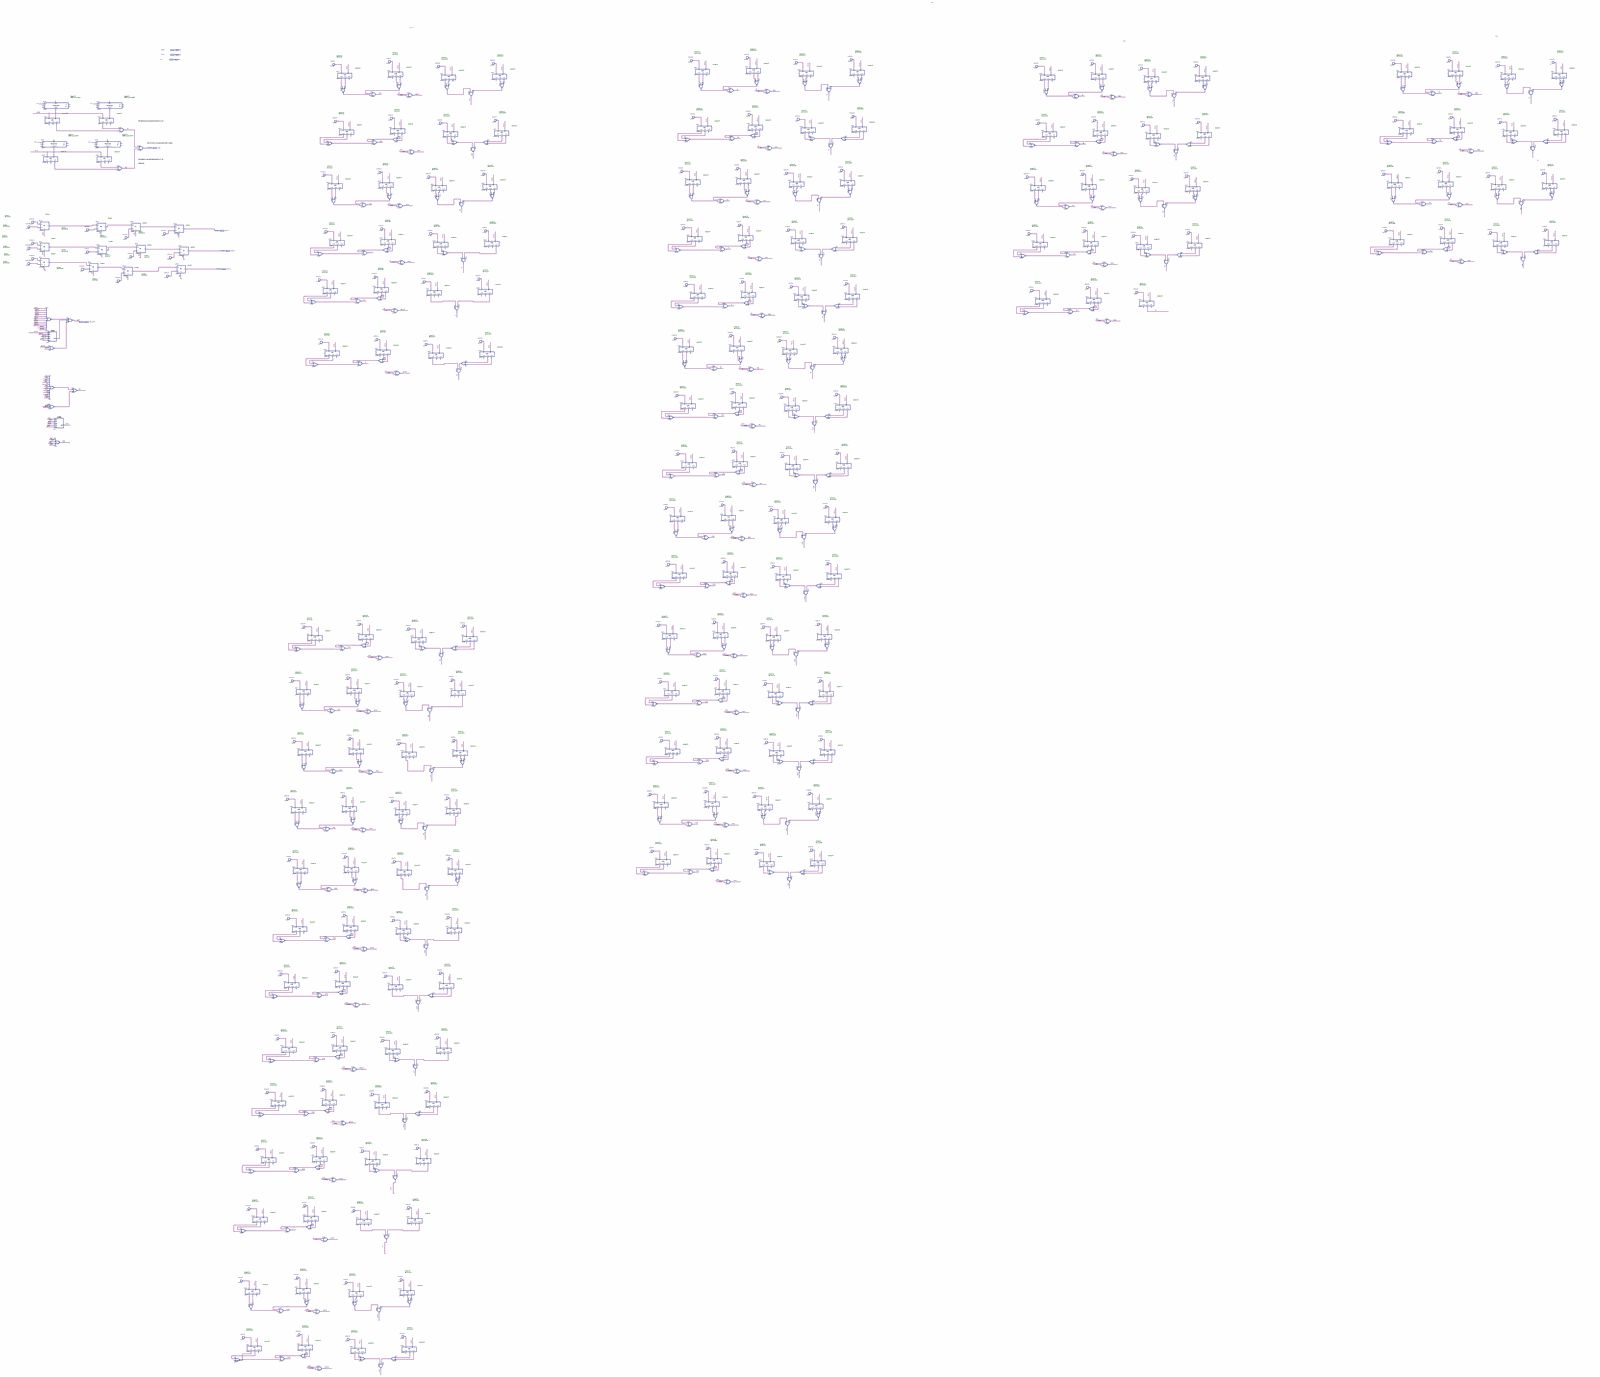
[diagram p0: schematic sheet, whole]
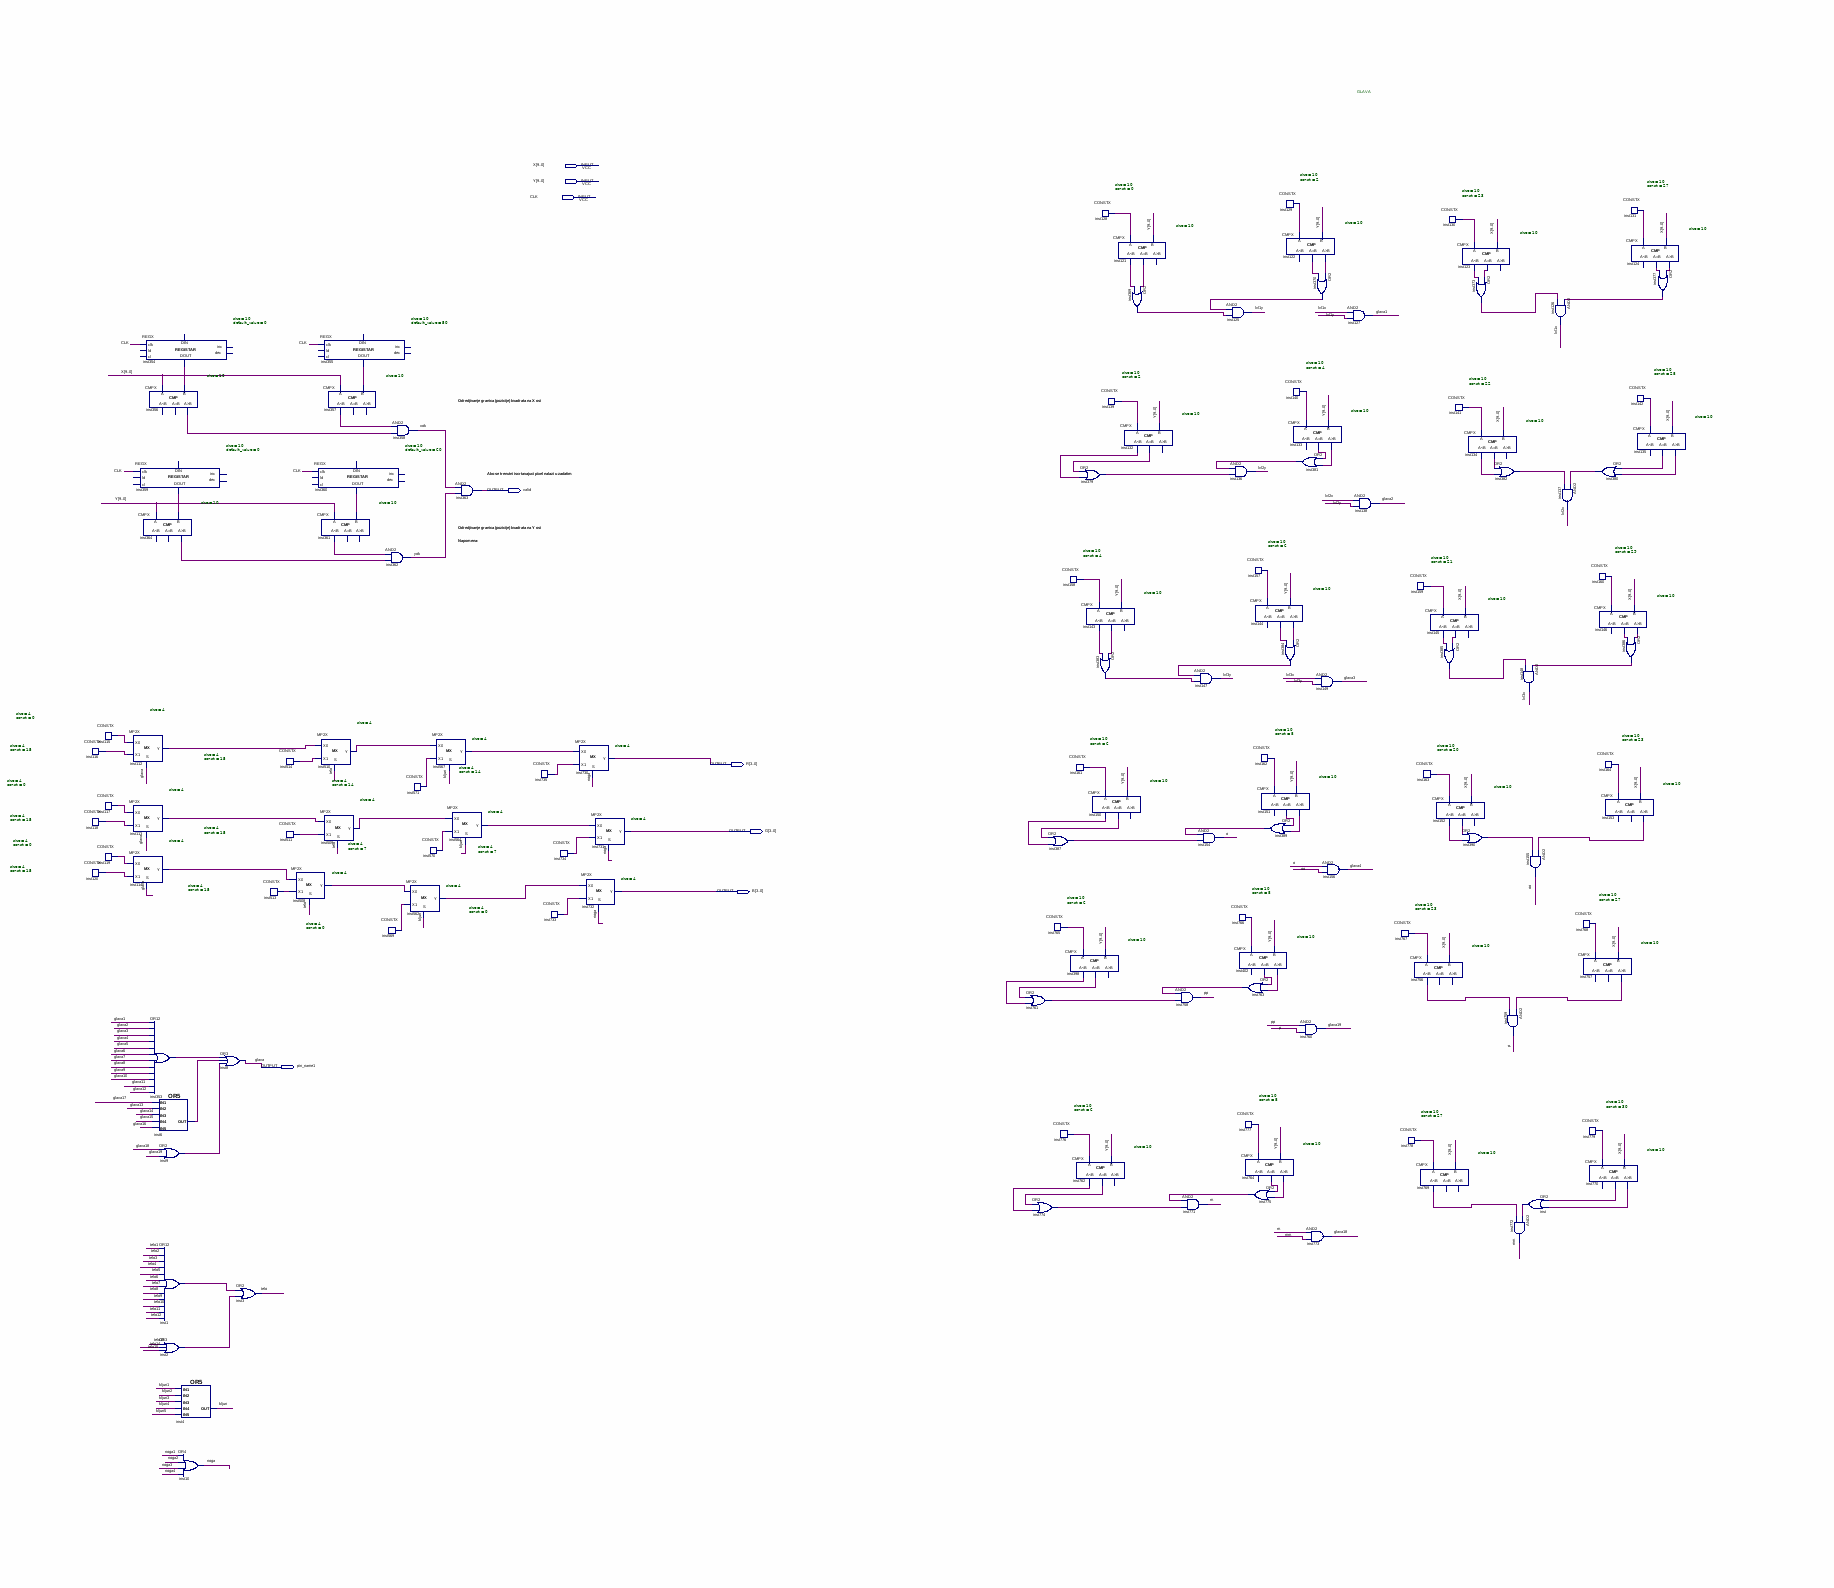
[diagram p1: schematic sheet, upper left part]
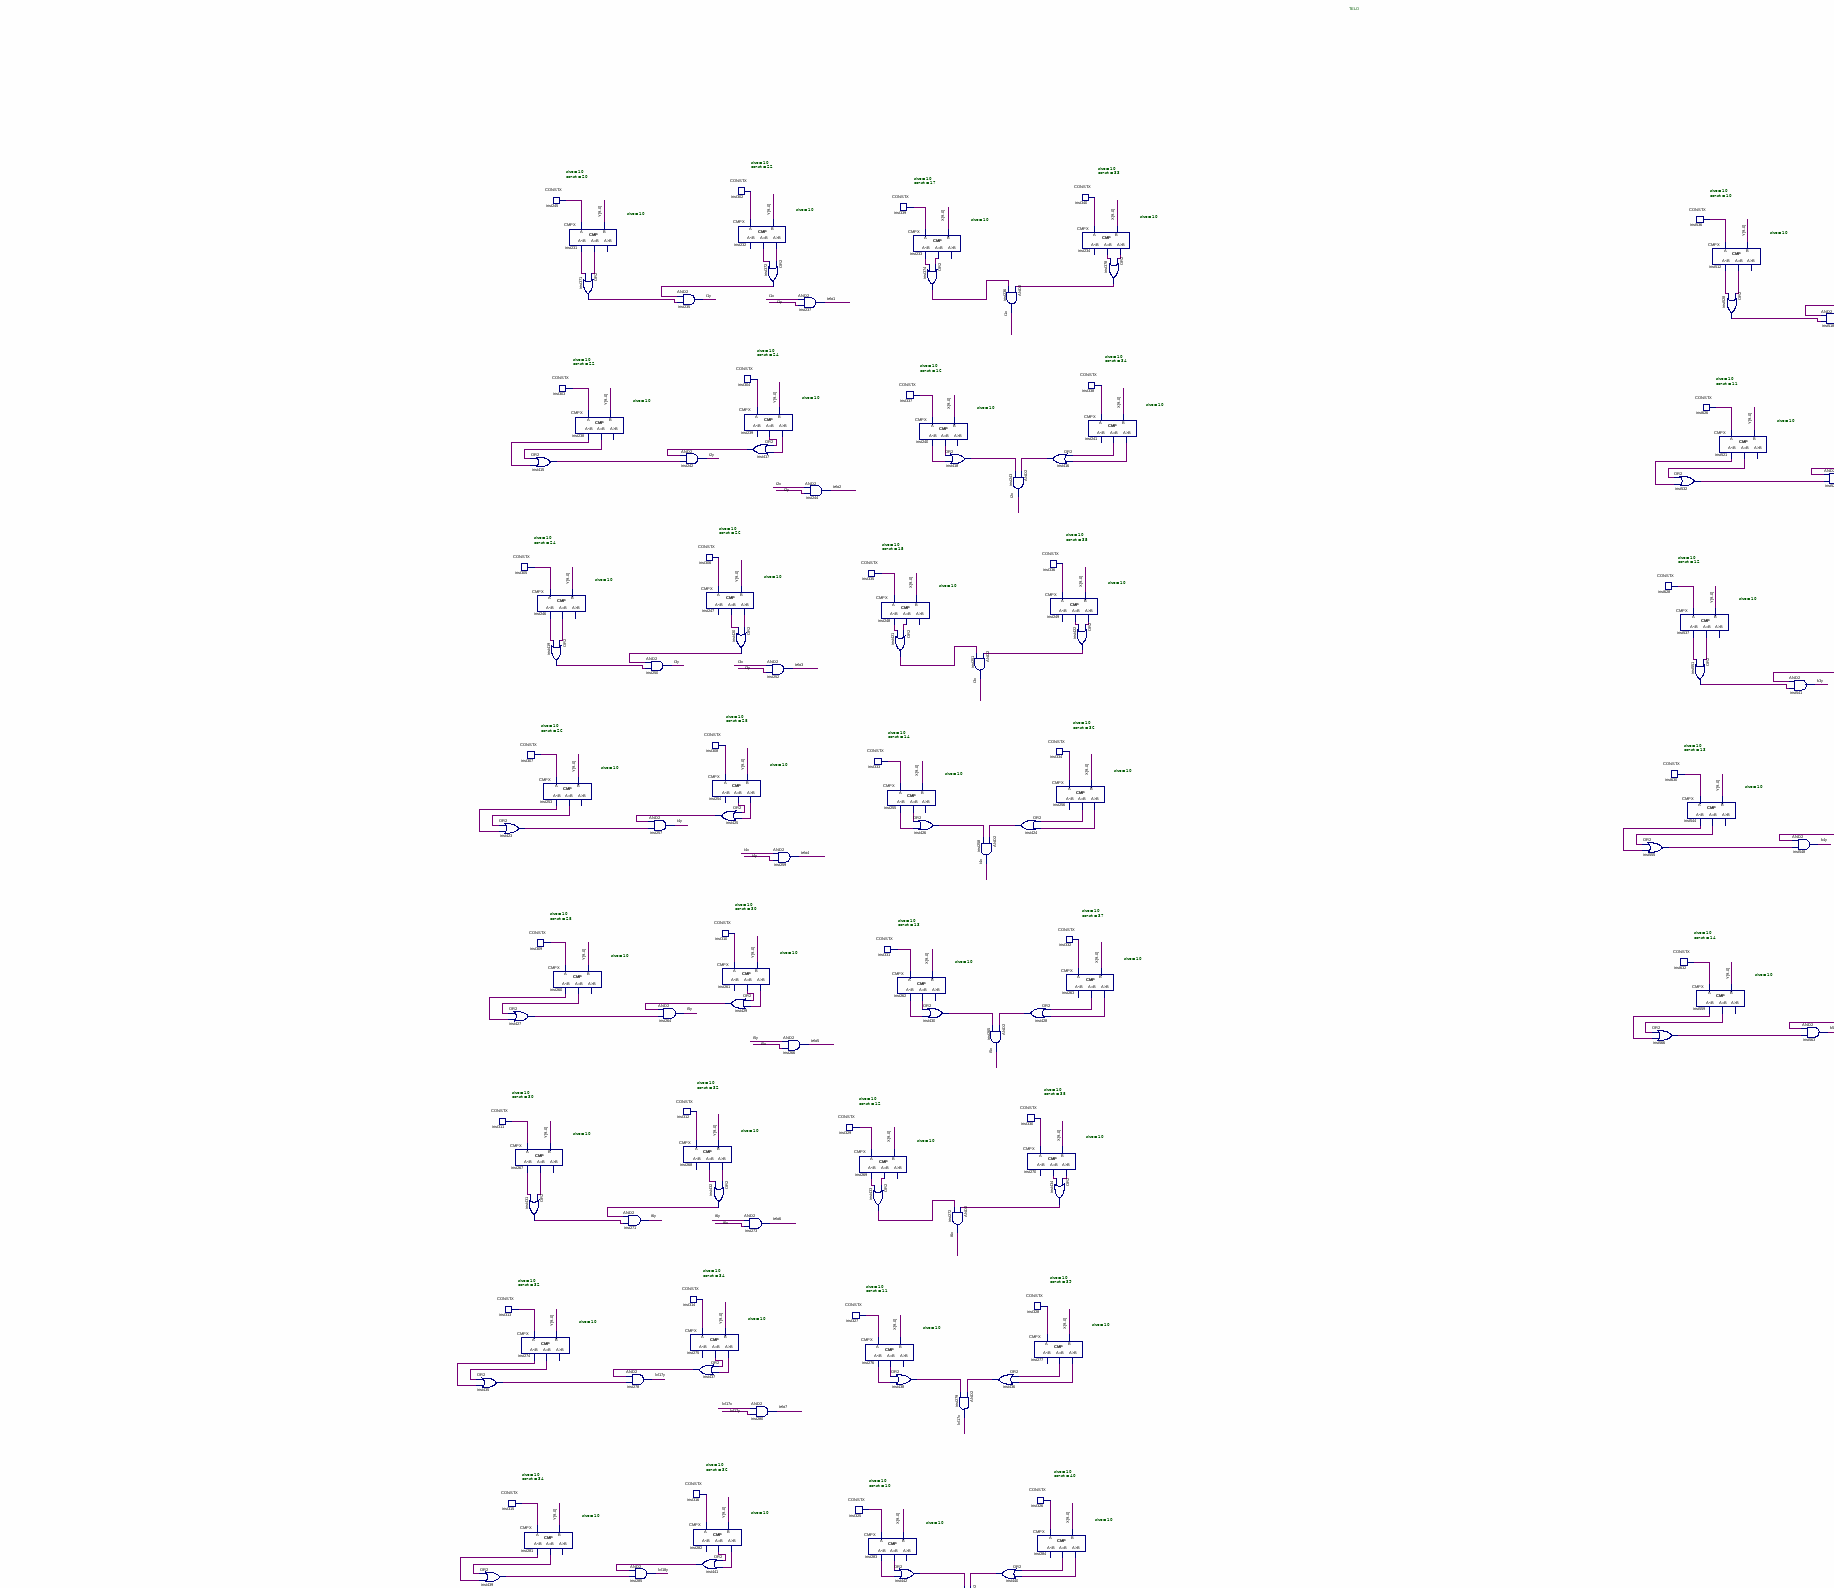
[diagram p2: schematic sheet, upper centre part]
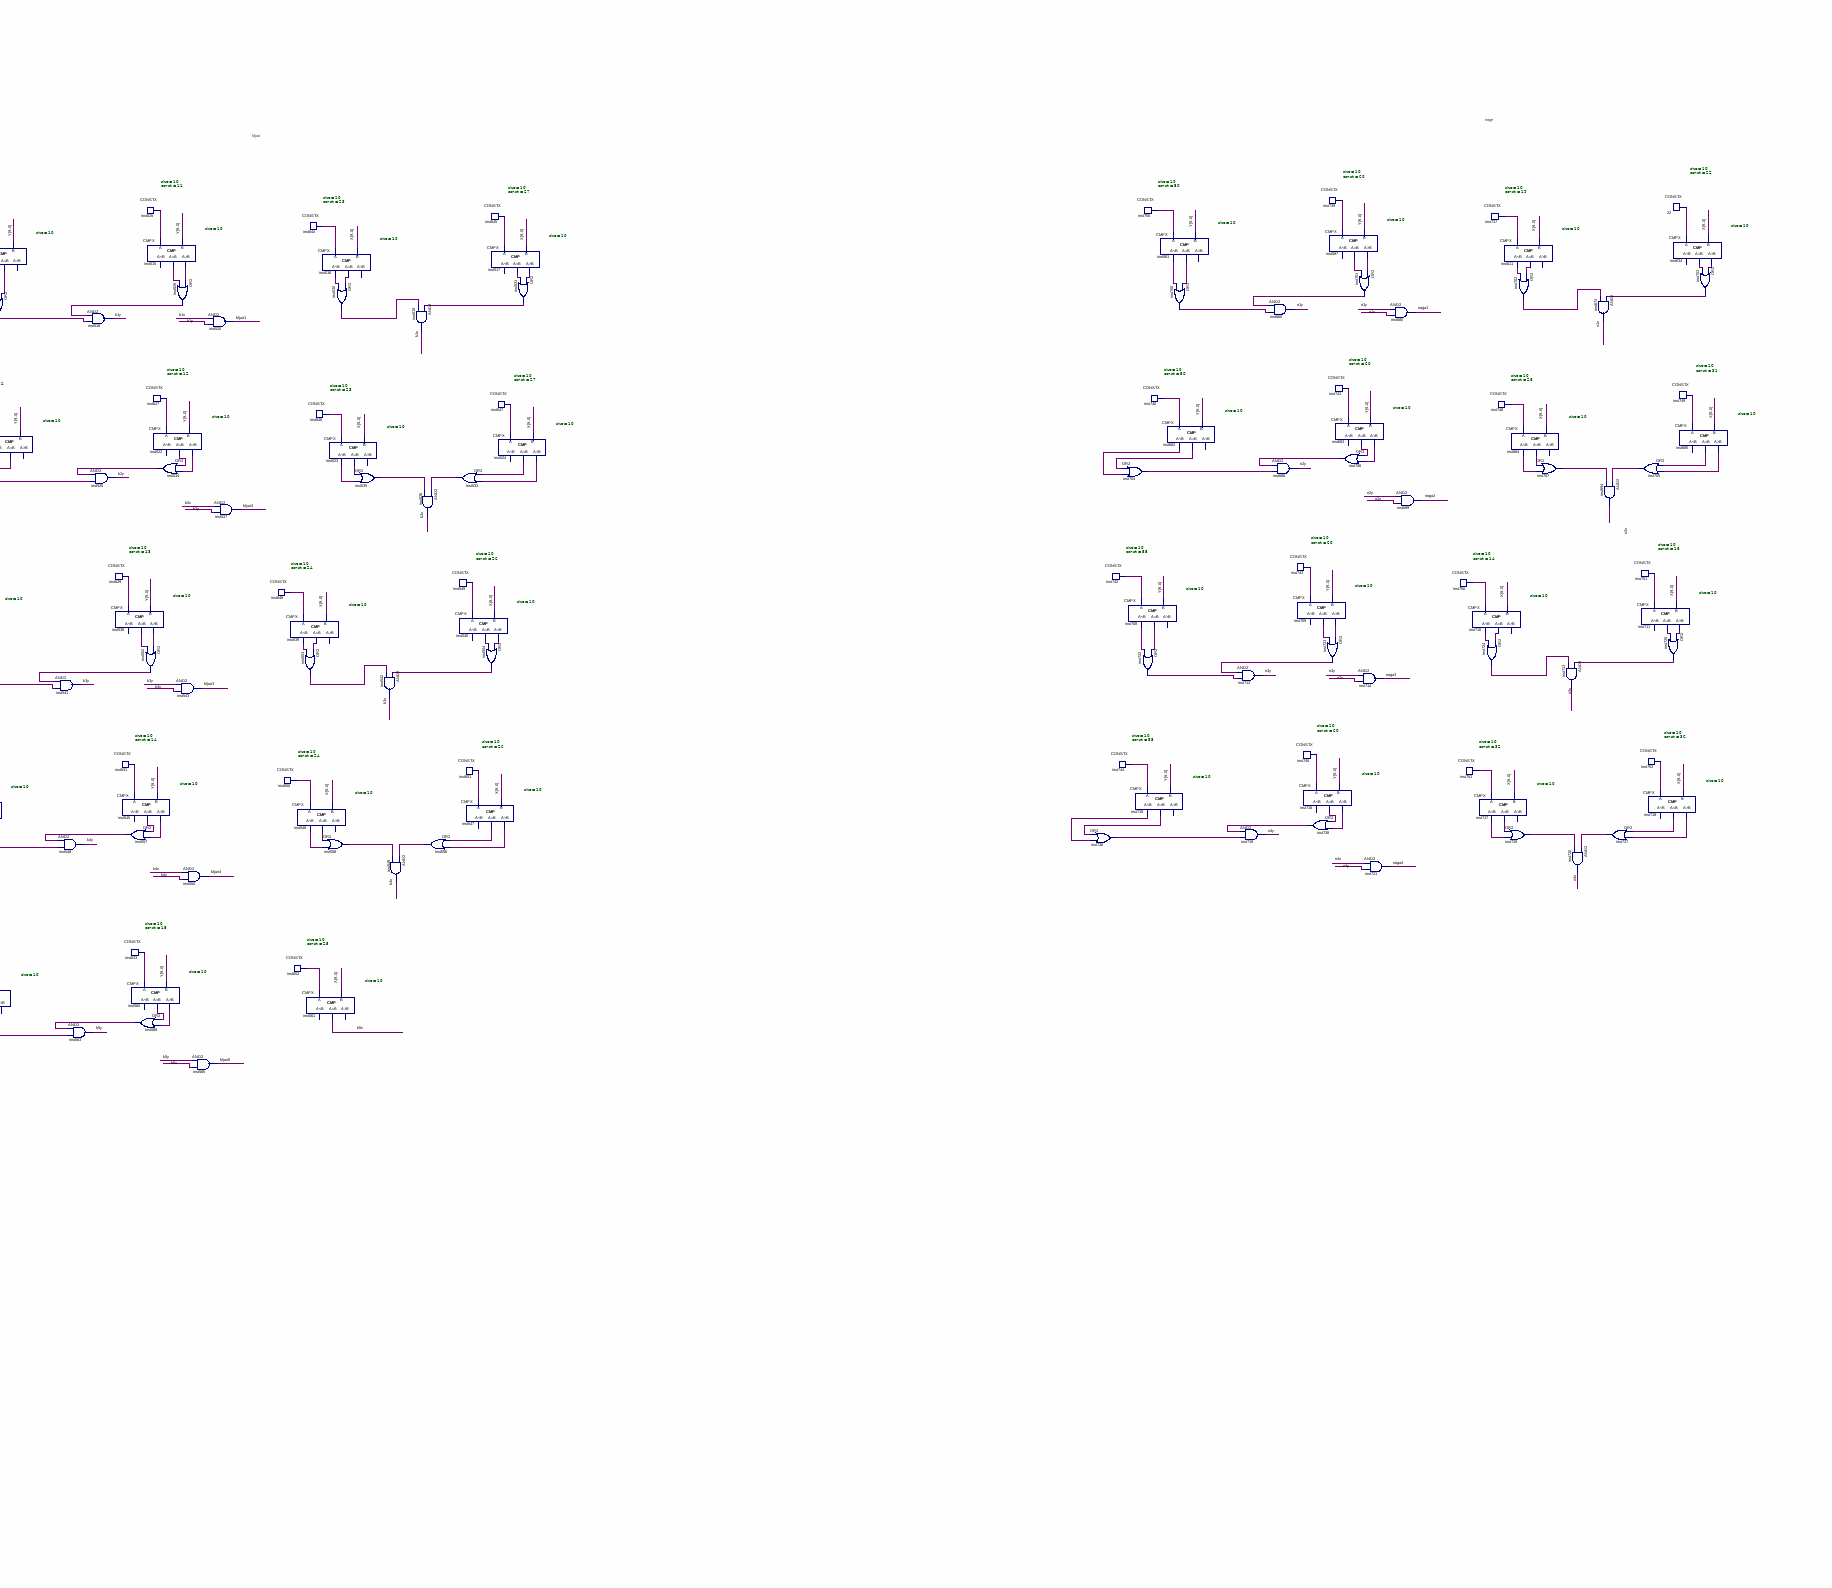
[diagram p3: schematic sheet, upper right part]
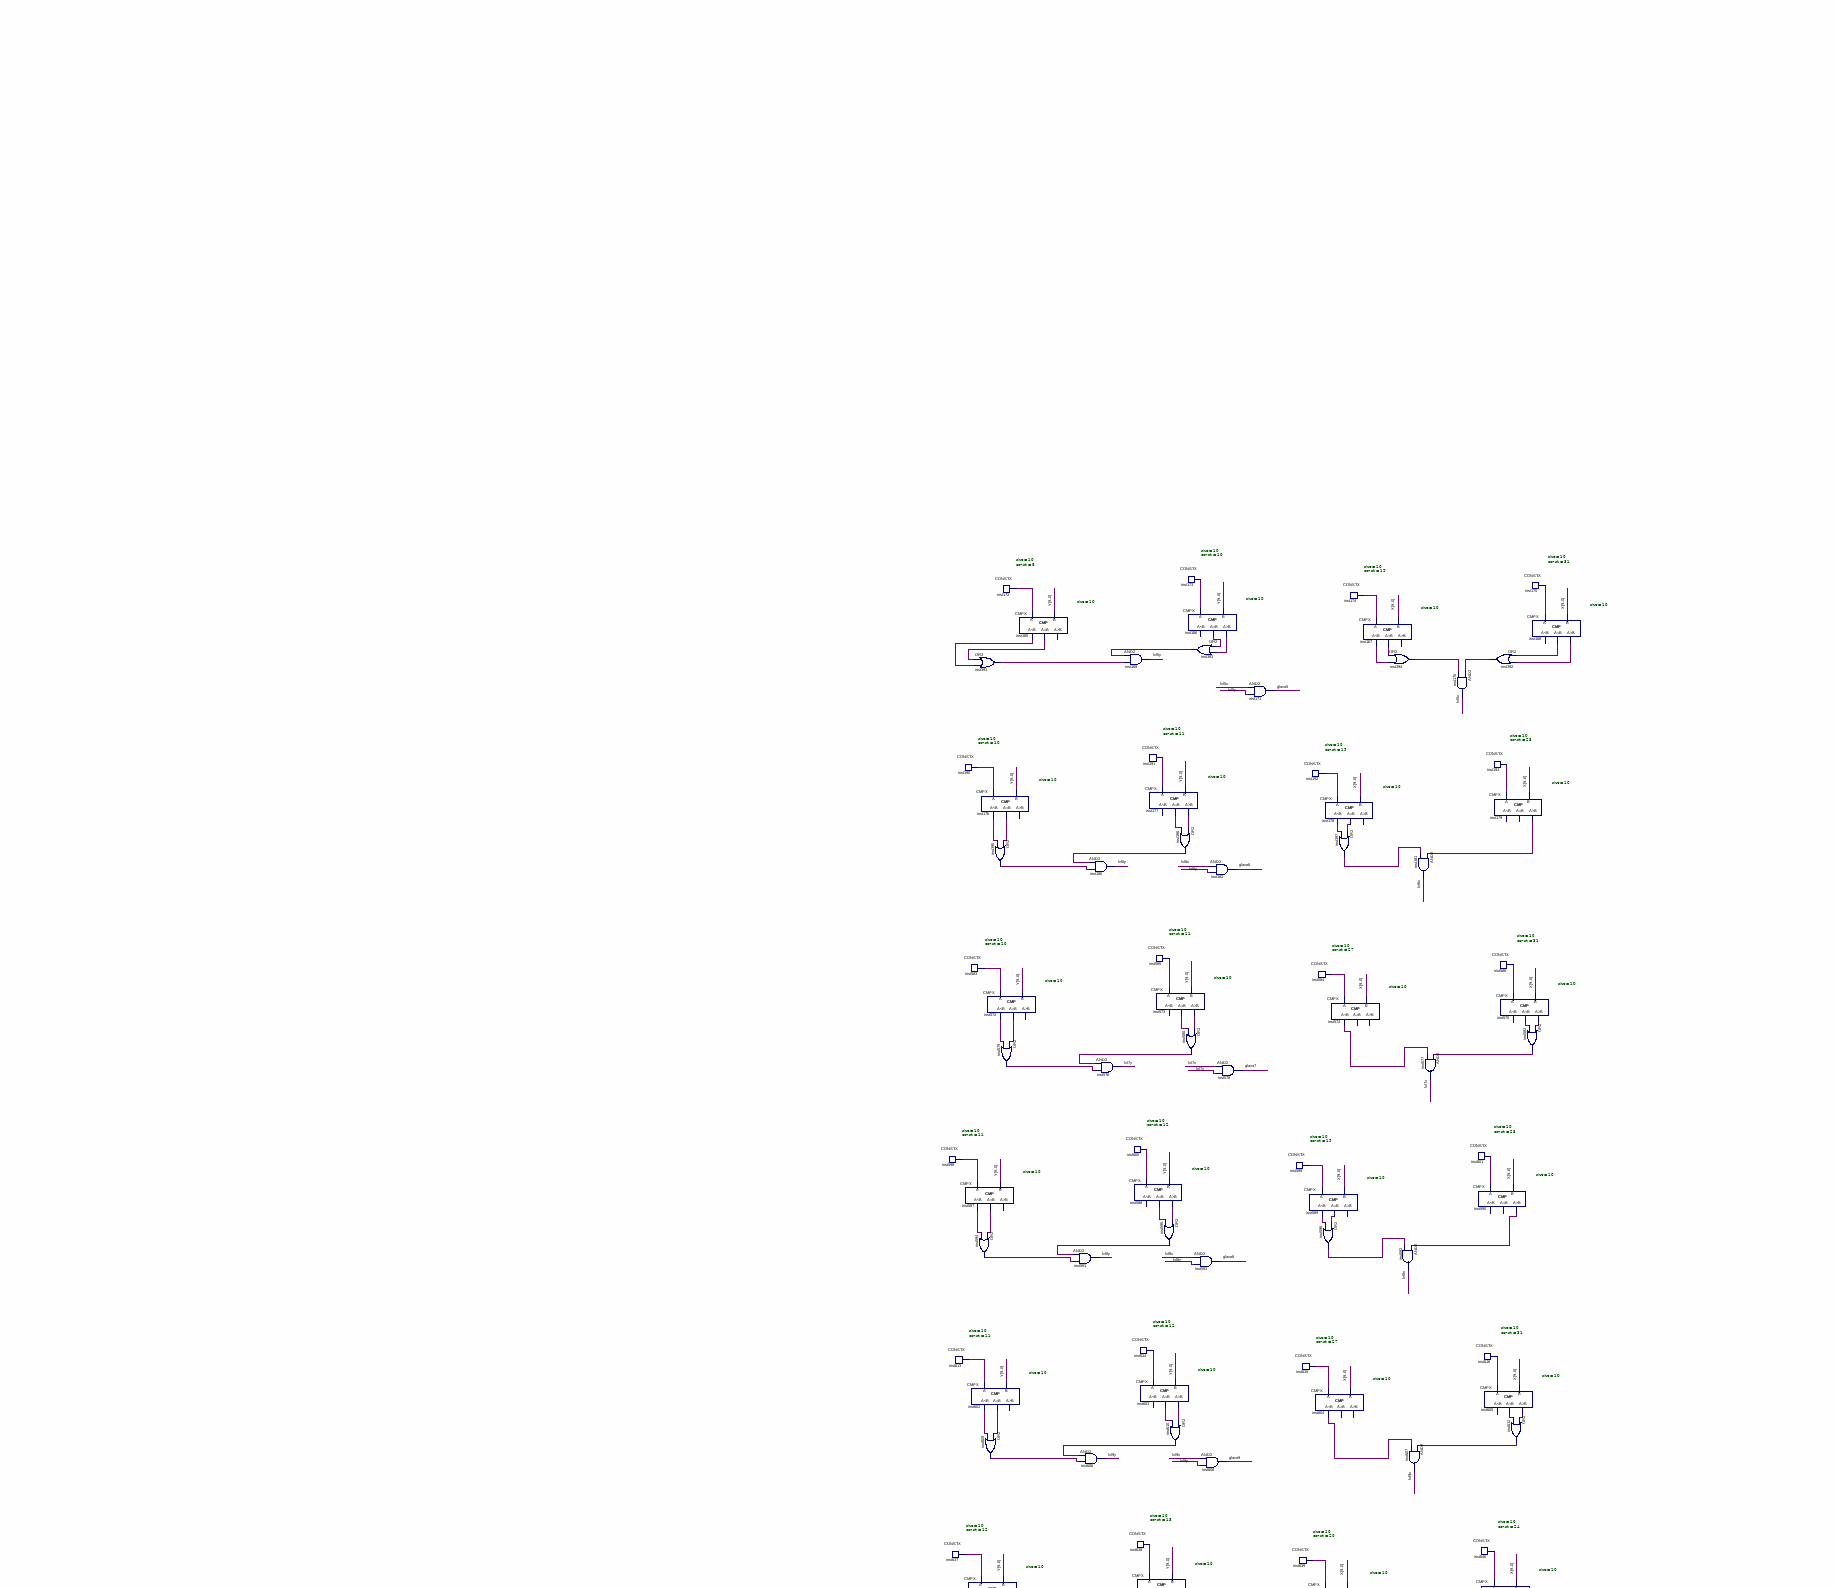
[diagram p4: schematic sheet, middle left part]
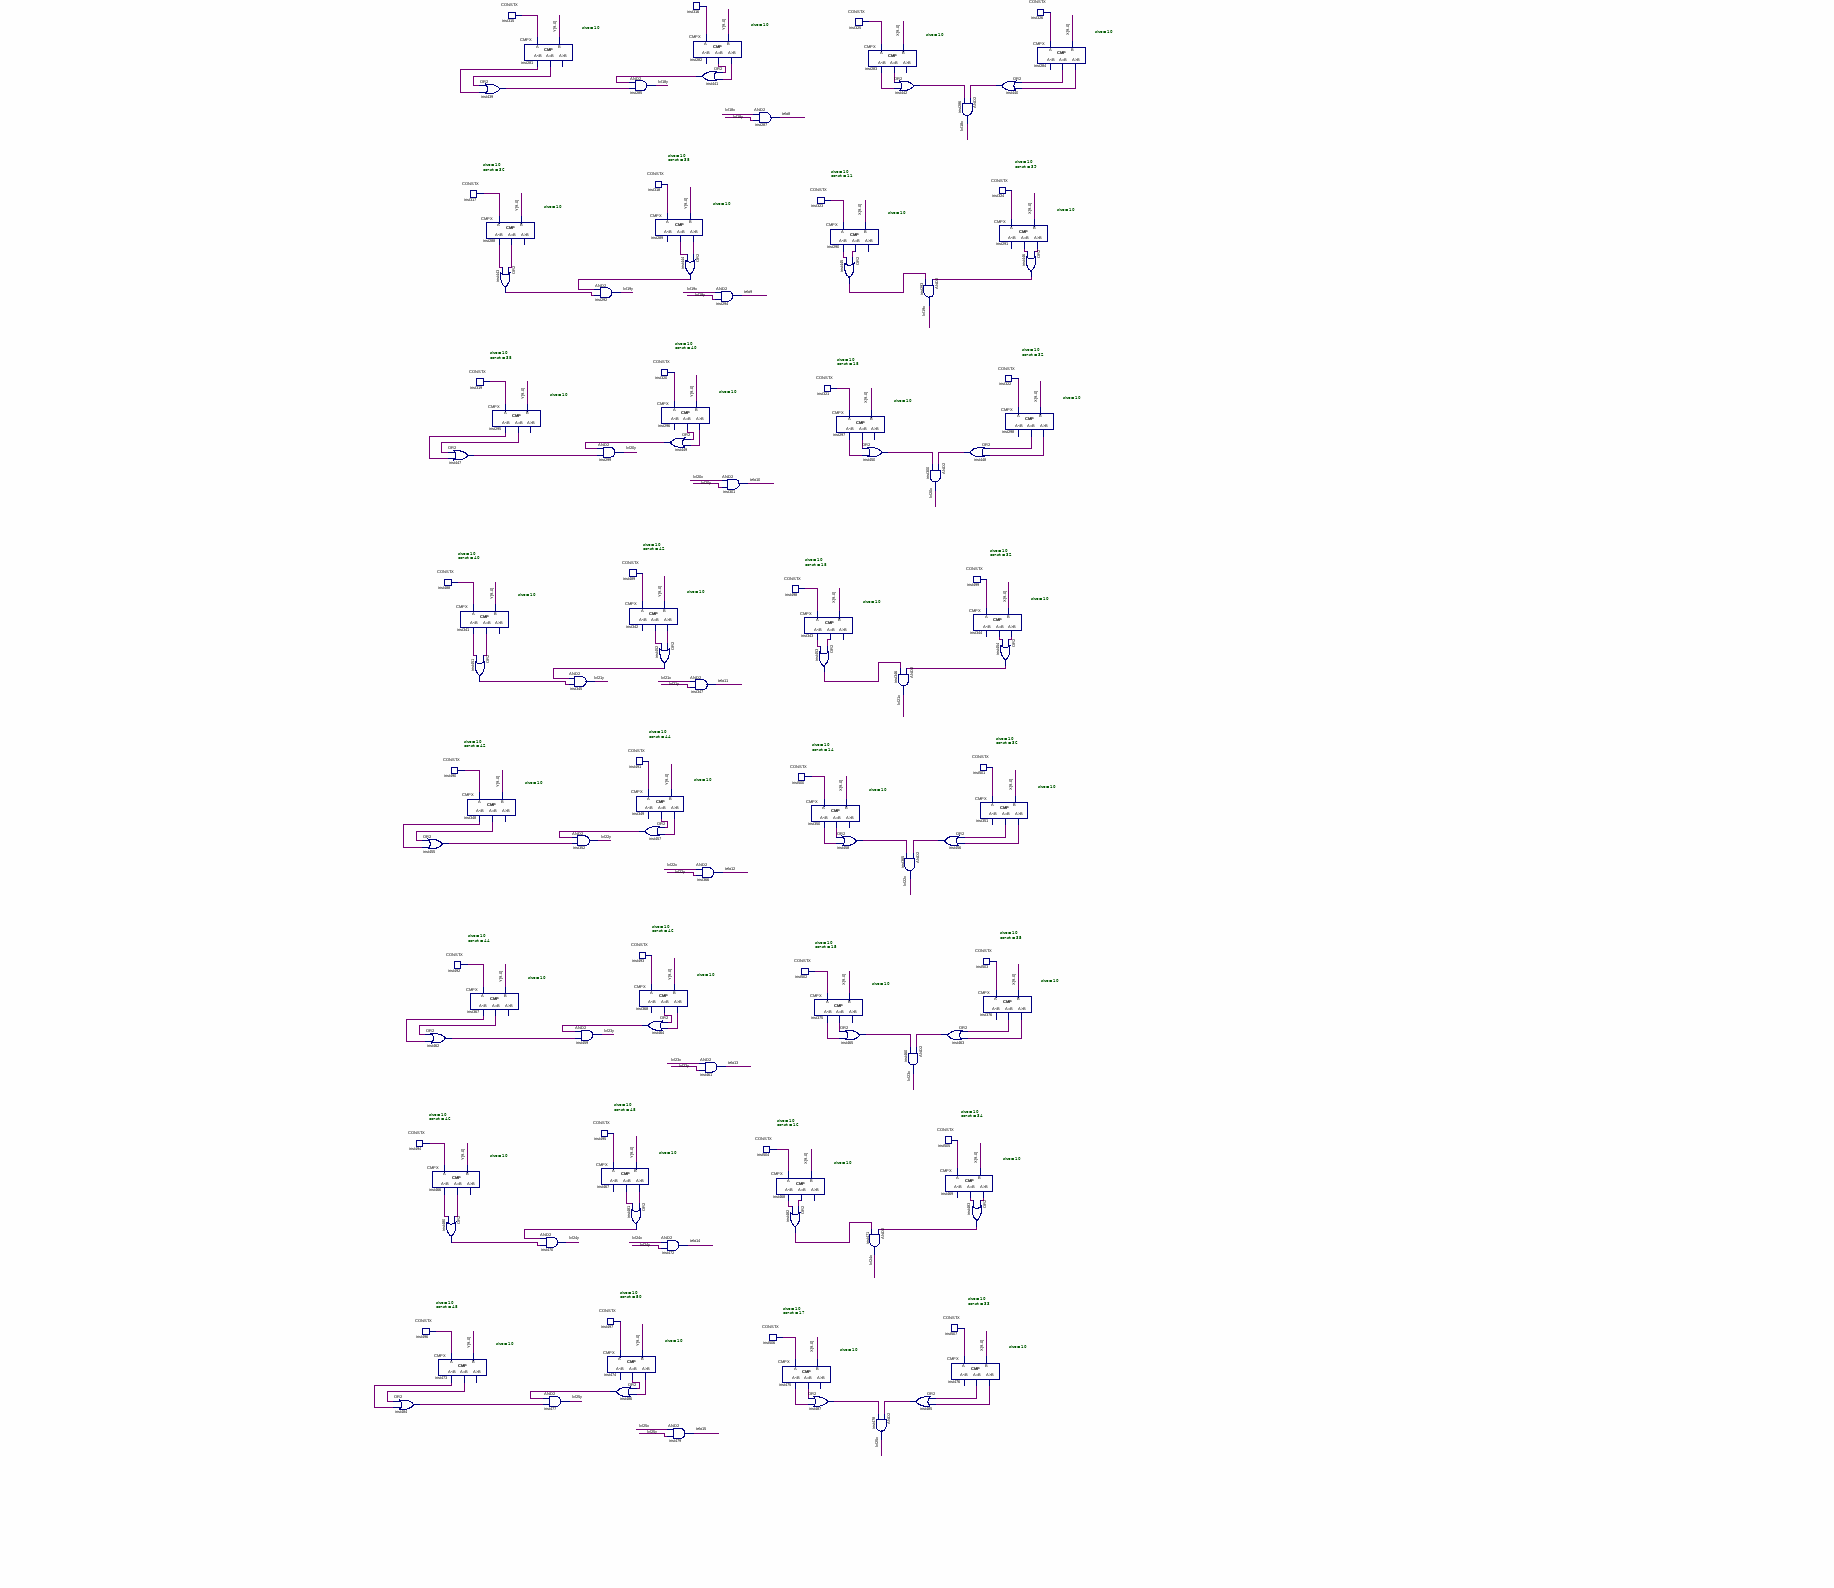
[diagram p5: schematic sheet, middle centre part]
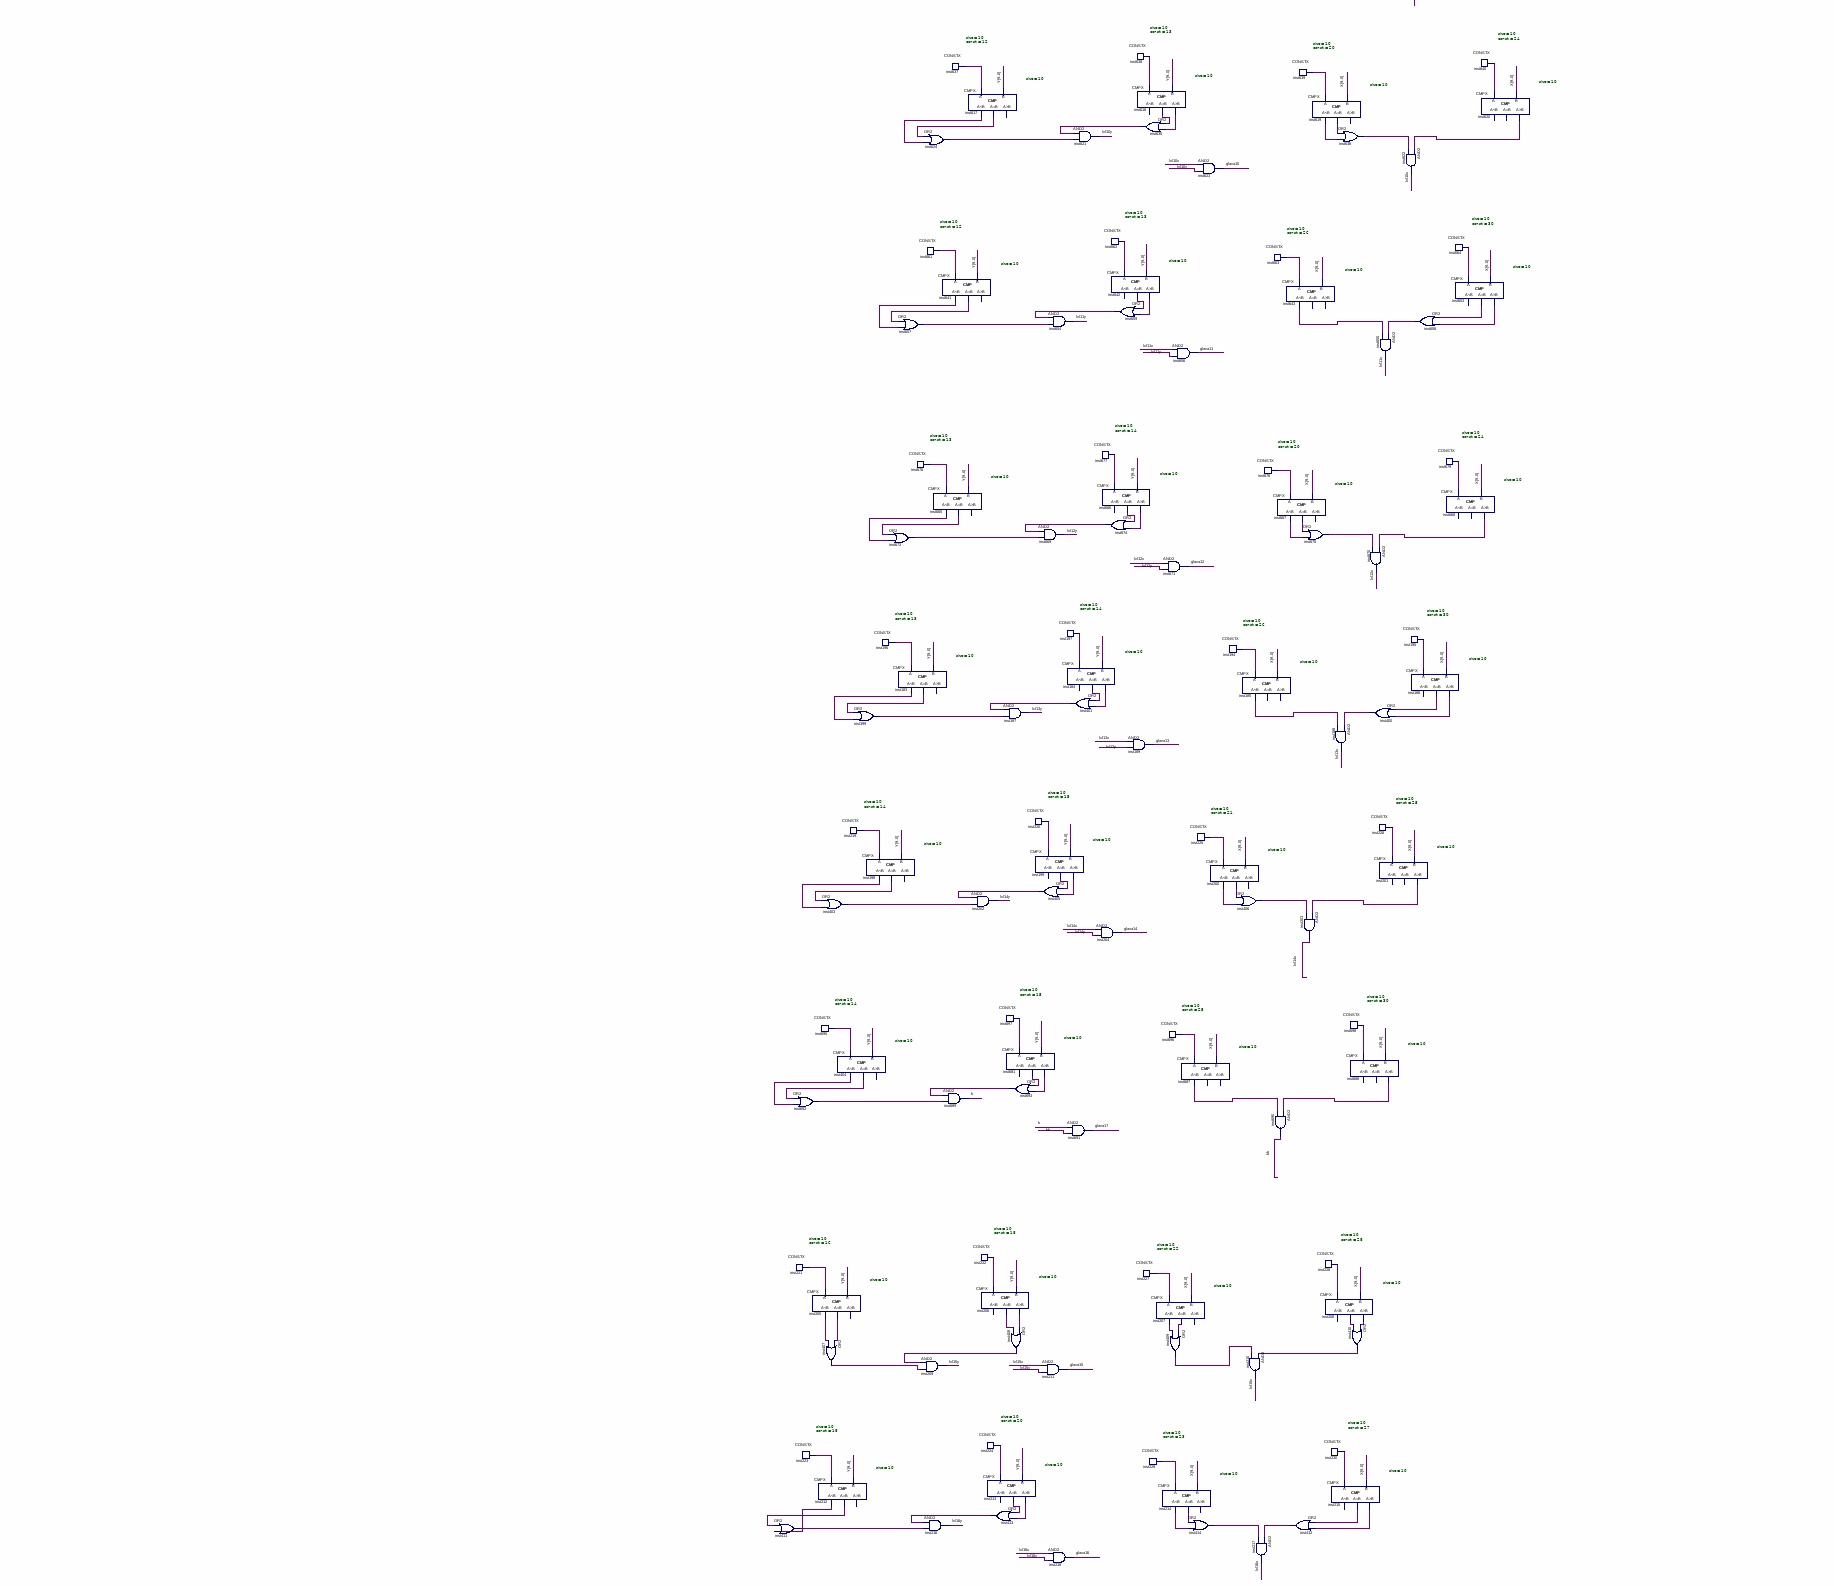
[diagram p6: schematic sheet, lower left part]
// Quartus schematic JAJE.bdf as structural Verilog: 672 symbols, 8 pins
module JAJE (
  input  [9:0] X,
  input  [9:0] Y,
  input  CLK,
  output valid,
  output [3:0] R,
  output [3:0] G,
  output [3:0] B,
  output pin_name1
);

  wire glava1, glava2, glava3, glava4, glava5, glava6, glava7, glava8, glava9, glava10, glava11, glava12,
       glava13, glava14, glava15, glava16, glava17, glava18, glava19, inst1_out, inst2_out, inst6_out,
       inst9_out, inst121_eq, inst121_ls, inst122_eq, inst122_gr, inst123_eq, inst123_ls, inst124_eq,
       inst124_gr, inst132_eq, inst132_ls, inst133_eq, inst133_gr, inst134_eq, inst134_ls, inst135_eq,
       inst135_gr, inst143_eq, inst143_ls, inst144_eq, inst144_gr, inst145_eq, inst145_ls, inst146_eq,
       inst146_gr, inst150_eq, inst150_ls, inst151_eq, inst151_gr, inst152_eq, inst152_ls, inst153_gr,
       inst165_eq, inst165_ls, inst166_eq, inst166_gr, inst167_eq, inst167_ls, inst168_eq, inst168_gr,
       inst176_eq, inst176_ls, inst177_eq, inst177_gr, inst178_eq, inst178_ls, inst179_gr, inst183_eq,
       inst183_ls, inst184_eq, inst184_gr, inst185_ls, inst186_eq, inst186_gr, inst198_eq, inst198_ls,
       inst199_eq, inst199_gr, inst200_eq, inst200_ls, inst201_gr, inst205_eq, inst205_ls, inst206_eq,
       inst206_gr, inst207_eq, inst207_ls, inst208_eq, inst208_gr, inst212_eq, inst212_ls, inst213_eq,
       inst213_gr, inst214_eq, inst214_ls, inst215_eq, inst215_gr, inst231_eq, inst231_ls, inst232_eq,
       inst232_gr, inst233_eq, inst233_ls, inst234_eq, inst234_gr, inst238_eq, inst238_ls, inst239_eq,
       inst239_gr, inst240_eq, inst240_ls, inst241_eq, inst241_gr, inst246_eq, inst246_ls, inst247_eq,
       inst247_gr, inst248_eq, inst248_ls, inst249_eq, inst249_gr, inst253_eq, inst253_ls, inst254_eq,
       inst254_gr, inst255_eq, inst255_ls, inst256_eq, inst256_gr, inst260_eq, inst260_ls, inst261_eq,
       inst261_gr, inst262_eq, inst262_ls, inst263_eq, inst263_gr, inst267_eq, inst267_ls, inst268_eq,
       inst268_gr, inst269_eq, inst269_ls, inst270_eq, inst270_gr, inst274_eq, inst274_ls, inst275_eq,
       inst275_gr, inst276_eq, inst276_ls, inst277_eq, inst277_gr, inst281_eq, inst281_ls, inst282_eq,
       inst282_gr, inst283_eq, inst283_ls, inst284_eq, inst284_gr, inst288_eq, inst288_ls, inst289_eq,
       inst289_gr, inst290_eq, inst290_ls, inst291_eq, inst291_gr, inst295_eq, inst295_ls, inst296_eq,
       inst296_gr, inst297_eq, inst297_ls, inst298_eq, inst298_gr, inst341_eq, inst341_ls, inst342_eq,
       inst342_gr, inst343_eq, inst343_ls, inst344_eq, inst344_gr, inst348_eq, inst348_ls, inst349_eq,
       inst349_gr, inst350_eq, inst350_ls, inst351_eq, inst351_gr, inst353_out, inst356_gr, inst357_ls,
       inst361_ls, inst364_gr, inst367_eq, inst367_ls, inst368_eq, inst368_gr, inst369_out, inst370_out,
       inst371_out, inst372_out, inst373_out, inst374_out, inst375_eq, inst375_ls, inst376_eq, inst376_gr,
       inst377_out, inst378_out, inst379_out, inst380_out, inst381_out, inst382_out, inst383_out,
       inst384_out, inst385_out, inst386_out, inst387_out, inst389_out, inst390_out, inst391_out,
       inst392_out, inst393_out, inst394_out, inst395_out, inst396_out, inst397_out, inst398_eq, inst398_ls,
       inst399_out, inst400_out, inst401_out, inst402_eq, inst402_gr, inst403_out, inst404_eq, inst404_ls,
       inst405_out, inst406_out, inst407_out, inst408_out, inst409_out, inst410_out, inst411_out,
       inst412_out, inst413_out, inst414_out, inst415_out, inst416_out, inst417_out, inst418_out,
       inst419_out, inst420_out, inst421_out, inst422_out, inst423_out, inst424_out, inst425_out,
       inst426_out, inst427_out, inst428_out, inst429_out, inst430_out, inst431_out, inst432_out,
       inst433_out, inst434_out, inst435_out, inst436_out, inst437_out, inst438_out, inst439_out,
       inst440_out, inst441_out, inst442_out, inst443_out, inst444_out, inst445_out, inst446_out,
       inst447_out, inst448_out, inst449_out, inst450_out, inst451_out, inst452_out, inst453_out,
       inst454_out, inst455_out, inst456_out, inst457_out, inst458_out, inst462_out, inst463_out,
       inst464_out, inst465_out, inst466_eq, inst466_ls, inst467_eq, inst467_gr, inst468_eq, inst468_ls,
       inst469_eq, inst469_gr, inst473_eq, inst473_ls, inst474_eq, inst474_gr, inst475_eq, inst475_ls,
       inst476_eq, inst476_gr, inst480_out, inst481_out, inst482_out, inst483_out, inst484_out, inst485_out,
       inst486_out, inst487_out, inst512_eq, inst512_ls, inst515_eq, inst515_gr, inst516_eq, inst516_ls,
       inst517_eq, inst517_gr, inst521_eq, inst521_ls, inst522_eq, inst522_gr, inst523_eq, inst523_ls,
       inst524_eq, inst524_gr, inst528_out, inst529_out, inst530_out, inst531_out, inst532_out, inst533_out,
       inst534_out, inst535_out, inst537_eq, inst537_ls, inst538_eq, inst538_gr, inst539_eq, inst539_ls,
       inst540_eq, inst540_gr, inst544_eq, inst544_ls, inst545_eq, inst545_gr, inst546_eq, inst546_ls,
       inst547_eq, inst547_gr, inst551_out, inst552_out, inst553_out, inst554_out, inst555_out, inst556_out,
       inst557_out, inst558_out, inst559_eq, inst559_ls, inst560_eq, inst560_gr, inst566_out, inst568_out,
       inst572_eq, inst572_ls, inst573_eq, inst573_gr, inst574_ls, inst575_eq, inst575_gr, inst579_out,
       inst580_out, inst581_eq, inst581_ls, inst582_out, inst587_eq, inst587_ls, inst588_eq, inst588_gr,
       inst589_eq, inst589_ls, inst590_gr, inst594_out, inst595_out, inst596_out, inst597_eq, inst597_gr,
       inst602_eq, inst602_ls, inst603_eq, inst603_gr, inst604_ls, inst605_eq, inst605_gr, inst609_out,
       inst610_out, inst611_eq, inst611_ls, inst612_out, inst617_eq, inst617_ls, inst618_eq, inst618_gr,
       inst619_eq, inst619_ls, inst620_gr, inst624_out, inst634_eq, inst634_gr, inst635_out, inst636_out,
       inst641_eq, inst641_ls, inst642_eq, inst642_gr, inst643_ls, inst653_eq, inst653_gr, inst657_out,
       inst658_out, inst659_out, inst665_eq, inst665_ls, inst666_eq, inst666_gr, inst667_eq, inst667_ls,
       inst668_gr, inst672_out, inst674_out, inst675_out, inst681_eq, inst681_gr, inst682_eq, inst682_ls,
       inst683_eq, inst683_gr, inst684_eq, inst684_ls, inst685_eq, inst685_gr, inst687_ls, inst688_gr,
       inst692_out, inst693_out, inst700_out, inst701_out, inst702_out, inst703_out, inst704_out,
       inst705_out, inst706_out, inst707_out, inst708_eq, inst708_ls, inst709_eq, inst709_gr, inst710_eq,
       inst710_ls, inst711_eq, inst711_gr, inst715_eq, inst715_ls, inst716_eq, inst716_gr, inst717_eq,
       inst717_ls, inst718_eq, inst718_gr, inst722_out, inst723_out, inst724_out, inst725_out, inst726_out,
       inst727_out, inst728_out, inst729_out, inst756_ls, inst757_gr, inst761_out, inst762_eq, inst762_ls,
       inst763_out, inst764_eq, inst764_gr, inst769_ls, inst770_eq, inst770_gr, inst774_out, inst775_out,
       inst_out, k, k1x, k1y, k2x, k2y, k3x, k3y, k4x, k4y, k5x, k5y, kk, kljun, kljun1, kljun2, kljun3,
       kljun4, kljun5, lvl1x, lvl1y, lvl2x, lvl2y, lvl3x, lvl3y, lvl5x, lvl5y, lvl6x, lvl6y, lvl7x, lvl7y,
       lvl8x, lvl8y, lvl9x, lvl9y, lvl10x, lvl10y, lvl11x, lvl11y, lvl12x, lvl12y, lvl13x, lvl13y, lvl14x,
       lvl14y, lvl15x, lvl15y, lvl16x, lvl16y, lvl17x, lvl17y, lvl18x, lvl18y, lvl19x, lvl19y, lvl20x,
       lvl20y, lvl21x, lvl21y, lvl22x, lvl22y, lvl23x, lvl23y, lvl24x, lvl24y, lvl25x, lvl25y, m, mm, n1x,
       n1y, n2x, n2y, n3x, n3y, n4x, n4y, noga, noga1, noga2, noga3, noga4, o, oo, p, pp, t1x, t1y, t2x, t2y,
       t3x, t3y, t4x, t4y, t5x, t5y, t6x, t6y, telo, telo1, telo2, telo3, telo4, telo5, telo6, telo7, telo8,
       telo9, telo10, telo11, telo12, telo13, telo14, telo15, xok, yok;
  wire [3:0] inst112_y, inst113_y, inst114_y, inst115_data, inst116_data, inst117_data, inst118_data,
       inst119_data, inst120_data, inst508_y, inst509_y, inst510_y, inst511_data, inst513_data, inst514_data,
       inst562_y, inst564_y, inst567_y, inst569_data, inst570_data, inst571_data, inst733_data, inst734_data,
       inst735_data;
  wire [9:0] inst128_data, inst129_data, inst130_data, inst131_data, inst139_data, inst140_data,
       inst141_data, inst142_data, inst157_data, inst158_data, inst159_data, inst160_data, inst161_data,
       inst162_data, inst163_data, inst164_data, inst172_data, inst173_data, inst174_data, inst175_data,
       inst190_data, inst191_data, inst192_data, inst193_data, inst194_data, inst195_data, inst196_data,
       inst197_data, inst219_data, inst220_data, inst221_data, inst222_data, inst223_data, inst224_data,
       inst225_data, inst226_data, inst227_data, inst228_data, inst229_data, inst230_data, inst245_data,
       inst302_data, inst303_data, inst304_data, inst305_data, inst306_data, inst307_data, inst308_data,
       inst309_data, inst310_data, inst311_data, inst312_data, inst313_data, inst314_data, inst315_data,
       inst316_data, inst317_data, inst318_data, inst319_data, inst320_data, inst321_data, inst322_data,
       inst323_data, inst324_data, inst325_data, inst326_data, inst327_data, inst328_data, inst329_data,
       inst330_data, inst331_data, inst332_data, inst333_data, inst334_data, inst335_data, inst336_data,
       inst337_data, inst338_data, inst339_data, inst340_data, inst354_data_out, inst355_data_out,
       inst359_data_out, inst360_data_out, inst488_data, inst489_data, inst490_data, inst491_data,
       inst492_data, inst493_data, inst494_data, inst495_data, inst496_data, inst497_data, inst498_data,
       inst499_data, inst500_data, inst501_data, inst502_data, inst503_data, inst504_data, inst505_data,
       inst506_data, inst507_data, inst536_data, inst583_data, inst584_data, inst585_data, inst586_data,
       inst598_data, inst599_data, inst600_data, inst601_data, inst613_data, inst614_data, inst615_data,
       inst616_data, inst625_data, inst626_data, inst627_data, inst628_data, inst629_data, inst630_data,
       inst631_data, inst632_data, inst633_data, inst637_data, inst638_data, inst639_data, inst640_data,
       inst644_data, inst645_data, inst646_data, inst647_data, inst648_data, inst649_data, inst650_data,
       inst651_data, inst652_data, inst661_data, inst662_data, inst663_data, inst664_data, inst676_data,
       inst677_data, inst678_data, inst679_data, inst695_data, inst696_data, inst697_data, inst698_data,
       inst737_data, inst739_data, inst740_data, inst741_data, inst742_data, inst743_data, inst744_data,
       inst745_data, inst748_data, inst749_data, inst750_data, inst751_data, inst752_data, inst753_data,
       inst755_data, inst765_data, inst766_data, inst767_data, inst768_data, inst776_data, inst777_data,
       inst778_data, inst779_data, n22_data;

  CONSTX #(.size(4), .\const (15)) inst116 (.data(inst116_data));
  CONSTX #(.size(4), .\const (15)) inst118 (.data(inst118_data));
  CONSTX #(.size(4), .\const (15)) inst120 (.data(inst120_data));
  CONSTX #(.size(4), .\const (0)) inst115 (.data(inst115_data));
  CONSTX #(.size(4), .\const (0)) inst117 (.data(inst117_data));
  CONSTX #(.size(4), .\const (0)) inst119 (.data(inst119_data));
  REGX #(.size(10), .default_value(0)) inst359 (
    .clk(CLK), .data_out(inst359_data_out));  // open: ld, cl, inc, dec, data_in
  MP2X #(.size(4)) inst112 (.S(pin_name1), .X0(inst115_data), .X1(inst116_data), .Y(inst112_y));
  MP2X #(.size(4)) inst113 (.S(pin_name1), .X0(inst117_data), .X1(inst118_data), .Y(inst113_y));
  MP2X #(.size(4)) inst114 (.S(pin_name1), .X0(inst119_data), .X1(inst120_data), .Y(inst114_y));
  REGX #(.size(10), .default_value(0)) inst354 (
    .clk(CLK), .data_out(inst354_data_out));  // open: ld, cl, inc, dec, data_in
  CMPX #(.size(10)) inst356 (.A(X), .B(inst354_data_out), .gr(inst356_gr));  // open: ls, eq
  CMPX #(.size(10)) inst364 (.A(Y), .B(inst359_data_out), .gr(inst364_gr));  // open: ls, eq
  or inst353 (inst353_out, glava1, glava2, glava3, glava4, glava5, glava6, glava7, glava8, glava9, glava10, glava11, glava12);
  or inst6 (inst6_out, glava17, glava13, glava14, glava15, glava16);
  or inst9 (inst9_out, glava18, glava19);
  or inst1 (inst1_out, telo1, telo2, telo3, telo4, telo5, telo6, telo7, telo8, telo9, telo10, telo11, telo12);
  or inst2 (inst2_out, telo13, telo14, telo15);
  or inst4 (kljun, kljun1, kljun2, kljun3, kljun4, kljun5);
  or inst10 (noga, noga1, noga2, noga3, noga4);
  or inst8 (pin_name1, inst353_out, inst6_out, inst9_out);
  or inst3 (telo, inst1_out, inst2_out);
  CONSTX #(.size(4), .\const (15)) inst513 (.data(inst513_data));
  CONSTX #(.size(4), .\const (15)) inst514 (.data(inst514_data));
  CONSTX #(.size(4), .\const (15)) inst511 (.data(inst511_data));
  REGX #(.size(10), .default_value(60)) inst360 (
    .clk(CLK), .data_out(inst360_data_out));  // open: ld, cl, inc, dec, data_in
  MP2X #(.size(4)) inst508 (.S(telo), .X0(inst114_y), .X1(inst513_data), .Y(inst508_y));
  REGX #(.size(10), .default_value(50)) inst355 (
    .clk(CLK), .data_out(inst355_data_out));  // open: ld, cl, inc, dec, data_in
  CMPX #(.size(10)) inst357 (.A(X), .B(inst355_data_out), .ls(inst357_ls));  // open: eq, gr
  CMPX #(.size(10)) inst361 (.A(Y), .B(inst360_data_out), .ls(inst361_ls));  // open: eq, gr
  MP2X #(.size(4)) inst510 (.S(telo), .X0(inst112_y), .X1(inst514_data), .Y(inst510_y));
  MP2X #(.size(4)) inst509 (.S(telo), .X0(inst113_y), .X1(inst511_data), .Y(inst509_y));
  and inst362 (yok, inst361_ls, inst364_gr);
  CONSTX #(.size(4), .\const (0)) inst569 (.data(inst569_data));
  and inst358 (xok, inst357_ls, inst356_gr);
  CONSTX #(.size(4), .\const (14)) inst571 (.data(inst571_data));
  MP2X #(.size(4)) inst562 (.S(kljun), .X0(inst508_y), .X1(inst569_data), .Y(inst562_y));
  MP2X #(.size(4)) inst567 (.S(kljun), .X0(inst510_y), .X1(inst571_data), .Y(inst567_y));
  CONSTX #(.size(4), .\const (7)) inst570 (.data(inst570_data));
  and inst363 (valid, xok, yok);
  MP2X #(.size(4)) inst564 (.S(kljun), .X0(inst509_y), .X1(inst570_data), .Y(inst564_y));
  CONSTX #(.size(4), .\const (14)) inst735 (.data(inst735_data));
  CONSTX #(.size(4), .\const (0)) inst733 (.data(inst733_data));
  CONSTX #(.size(4), .\const (7)) inst734 (.data(inst734_data));
  MP2X #(.size(4)) inst730 (.S(noga), .X0(inst567_y), .X1(inst735_data), .Y(R));
  MP2X #(.size(4)) inst731 (.S(noga), .X0(inst564_y), .X1(inst734_data), .Y(G));
  MP2X #(.size(4)) inst732 (.S(noga), .X0(inst562_y), .X1(inst733_data), .Y(B));
  or inst692 (inst692_out, inst404_eq, inst404_ls);
  CONSTX #(.size(10), .\const (16)) inst221 (.data(inst221_data));
  CONSTX #(.size(10), .\const (18)) inst223 (.data(inst223_data));
  or inst411 (inst411_out, inst212_eq, inst212_ls);
  or inst403 (inst403_out, inst198_eq, inst198_ls);
  CONSTX #(.size(10), .\const (14)) inst695 (.data(inst695_data));
  CMPX #(.size(10)) inst205 (.A(inst221_data), .B(Y), .ls(inst205_ls), .eq(inst205_eq));  // open: gr
  or inst407 (inst407_out, inst205_eq, inst205_ls);
  CMPX #(.size(10)) inst212 (.A(inst223_data), .B(Y), .ls(inst212_ls), .eq(inst212_eq));  // open: gr
  CONSTX #(.size(10), .\const (14)) inst219 (.data(inst219_data));
  CMPX #(.size(10)) inst404 (.A(inst695_data), .B(Y), .ls(inst404_ls), .eq(inst404_eq));  // open: gr
  CONSTX #(.size(10), .\const (13)) inst196 (.data(inst196_data));
  or inst399 (inst399_out, inst183_eq, inst183_ls);
  CMPX #(.size(10)) inst198 (.A(inst219_data), .B(Y), .ls(inst198_ls), .eq(inst198_eq));  // open: gr
  or inst657 (inst657_out, inst641_eq, inst641_ls);
  or inst672 (inst672_out, inst665_eq, inst665_ls);
  CMPX #(.size(10)) inst183 (.A(inst196_data), .B(Y), .ls(inst183_ls), .eq(inst183_eq));  // open: gr
  or inst624 (inst624_out, inst617_eq, inst617_ls);
  CONSTX #(.size(10), .\const (12)) inst661 (.data(inst661_data));
  CONSTX #(.size(10), .\const (13)) inst676 (.data(inst676_data));
  and inst209 (lvl15y, inst408_out, inst407_out);
  and inst216 (lvl16y, inst413_out, inst411_out);
  CONSTX #(.size(10), .\const (11)) inst598 (.data(inst598_data));
  CONSTX #(.size(10), .\const (11)) inst613 (.data(inst613_data));
  CONSTX #(.size(10), .\const (12)) inst637 (.data(inst637_data));
  CMPX #(.size(10)) inst641 (.A(inst661_data), .B(Y), .ls(inst641_ls), .eq(inst641_eq));  // open: gr
  CMPX #(.size(10)) inst665 (.A(inst676_data), .B(Y), .ls(inst665_ls), .eq(inst665_eq));  // open: gr
  and inst689 (k, inst693_out, inst692_out);
  or inst391 (inst391_out, inst165_eq, inst165_ls);
  CONSTX #(.size(10), .\const (10)) inst190 (.data(inst190_data));
  CMPX #(.size(10)) inst176 (.A(inst190_data), .B(Y), .ls(inst176_ls), .eq(inst176_eq));  // open: gr
  CONSTX #(.size(10), .\const (10)) inst583 (.data(inst583_data));
  CMPX #(.size(10)) inst587 (.A(inst598_data), .B(Y), .ls(inst587_ls), .eq(inst587_eq));  // open: gr
  or inst594 (inst594_out, inst587_eq, inst587_ls);
  CMPX #(.size(10)) inst602 (.A(inst613_data), .B(Y), .ls(inst602_ls), .eq(inst602_eq));  // open: gr
  CMPX #(.size(10)) inst617 (.A(inst637_data), .B(Y), .ls(inst617_ls), .eq(inst617_eq));  // open: gr
  and inst202 (lvl14y, inst405_out, inst403_out);
  CONSTX #(.size(10), .\const (18)) inst222 (.data(inst222_data));
  CMPX #(.size(10)) inst206 (.A(inst222_data), .B(Y), .eq(inst206_eq), .gr(inst206_gr));  // open: ls
  CONSTX #(.size(10), .\const (8)) inst172 (.data(inst172_data));
  or inst395 (inst395_out, inst176_eq, inst176_ls);
  CMPX #(.size(10)) inst572 (.A(inst583_data), .B(Y), .ls(inst572_ls), .eq(inst572_eq));  // open: gr
  or inst579 (inst579_out, inst572_eq, inst572_ls);
  or inst609 (inst609_out, inst602_eq, inst602_ls);
  CONSTX #(.size(10), .\const (15)) inst697 (.data(inst697_data));
  CMPX #(.size(10)) inst681 (.A(inst697_data), .B(Y), .eq(inst681_eq), .gr(inst681_gr));  // open: ls
  CONSTX #(.size(10), .\const (20)) inst224 (.data(inst224_data));
  CMPX #(.size(10)) inst213 (.A(inst224_data), .B(Y), .eq(inst213_eq), .gr(inst213_gr));  // open: ls
  or inst413 (inst413_out, inst213_eq, inst213_gr);
  or inst761 (inst761_out, inst398_eq, inst398_ls);
  CMPX #(.size(10)) inst165 (.A(inst172_data), .B(Y), .ls(inst165_ls), .eq(inst165_eq));  // open: gr
  and inst187 (lvl13y, inst401_out, inst399_out);
  CONSTX #(.size(10), .\const (15)) inst220 (.data(inst220_data));
  or inst693 (inst693_out, inst681_eq, inst681_gr);
  or inst408 (inst408_out, inst206_gr, inst206_eq);
  or inst387 (inst387_out, inst150_eq, inst150_ls);
  CONSTX #(.size(10), .\const (6)) inst765 (.data(inst765_data));
  CONSTX #(.size(10), .\const (6)) inst776 (.data(inst776_data));
  or inst774 (inst774_out, inst762_eq, inst762_ls);
  and inst654 (lvl11y, inst659_out, inst657_out);
  and inst669 (lvl12y, inst674_out, inst672_out);
  CMPX #(.size(10)) inst199 (.A(inst220_data), .B(Y), .eq(inst199_eq), .gr(inst199_gr));  // open: ls
  or inst405 (inst405_out, inst199_eq, inst199_gr);
  and inst211 (glava15, lvl15x, lvl15y);
  and inst218 (glava16, lvl16x, lvl16y);
  CONSTX #(.size(10), .\const (4)) inst158 (.data(inst158_data));
  CONSTX #(.size(10), .\const (6)) inst161 (.data(inst161_data));
  CMPX #(.size(10)) inst398 (.A(inst765_data), .B(Y), .ls(inst398_ls), .eq(inst398_eq));  // open: gr
  CMPX #(.size(10)) inst762 (.A(inst776_data), .B(Y), .ls(inst762_ls), .eq(inst762_eq));  // open: gr
  and inst591 (lvl8y, inst595_out, inst594_out);
  and inst621 (lvl10y, inst635_out, inst624_out);
  CONSTX #(.size(10), .\const (14)) inst197 (.data(inst197_data));
  CMPX #(.size(10)) inst184 (.A(inst197_data), .B(Y), .eq(inst184_eq), .gr(inst184_gr));  // open: ls
  or inst401 (inst401_out, inst184_eq, inst184_gr);
  and inst691 (glava17, k, kk);
  CONSTX #(.size(10), .\const (0)) inst128 (.data(inst128_data));
  CONSTX #(.size(10), .\const (2)) inst139 (.data(inst139_data));
  or inst379 (inst379_out, inst132_eq, inst132_ls);
  CMPX #(.size(10)) inst143 (.A(inst158_data), .B(Y), .ls(inst143_ls), .eq(inst143_eq));  // open: gr
  or inst383 (inst383_out, inst143_eq, inst143_ls);
  CMPX #(.size(10)) inst150 (.A(inst161_data), .B(Y), .ls(inst150_ls), .eq(inst150_eq));  // open: gr
  and inst180 (lvl6y, inst396_out, inst395_out);
  and inst576 (lvl7y, inst580_out, inst579_out);
  and inst606 (lvl9y, inst610_out, inst609_out);
  CONSTX #(.size(10), .\const (13)) inst662 (.data(inst662_data));
  CONSTX #(.size(10), .\const (14)) inst677 (.data(inst677_data));
  CMPX #(.size(10)) inst666 (.A(inst677_data), .B(Y), .eq(inst666_eq), .gr(inst666_gr));  // open: ls
  and inst204 (glava14, lvl14x, lvl14y);
  CMPX #(.size(10)) inst121 (.A(inst128_data), .B(Y), .ls(inst121_ls), .eq(inst121_eq));  // open: gr
  or inst369 (inst369_out, inst121_eq, inst121_ls);
  CMPX #(.size(10)) inst132 (.A(inst139_data), .B(Y), .ls(inst132_ls), .eq(inst132_eq));  // open: gr
  and inst169 (lvl5y, inst393_out, inst391_out);
  CONSTX #(.size(10), .\const (12)) inst600 (.data(inst600_data));
  CMPX #(.size(10)) inst588 (.A(inst600_data), .B(Y), .eq(inst588_eq), .gr(inst588_gr));  // open: ls
  CONSTX #(.size(10), .\const (13)) inst638 (.data(inst638_data));
  CMPX #(.size(10)) inst642 (.A(inst662_data), .B(Y), .eq(inst642_eq), .gr(inst642_gr));  // open: ls
  or inst659 (inst659_out, inst642_eq, inst642_gr);
  or inst674 (inst674_out, inst666_eq, inst666_gr);
  and inst189 (glava13, lvl13x, lvl13y);
  CONSTX #(.size(10), .\const (11)) inst191 (.data(inst191_data));
  CMPX #(.size(10)) inst177 (.A(inst191_data), .B(Y), .eq(inst177_eq), .gr(inst177_gr));  // open: ls
  CONSTX #(.size(10), .\const (11)) inst585 (.data(inst585_data));
  CMPX #(.size(10)) inst573 (.A(inst585_data), .B(Y), .eq(inst573_eq), .gr(inst573_gr));  // open: ls
  CONSTX #(.size(10), .\const (12)) inst614 (.data(inst614_data));
  CMPX #(.size(10)) inst603 (.A(inst614_data), .B(Y), .eq(inst603_eq), .gr(inst603_gr));  // open: ls
  CMPX #(.size(10)) inst618 (.A(inst638_data), .B(Y), .eq(inst618_eq), .gr(inst618_gr));  // open: ls
  or inst635 (inst635_out, inst618_eq, inst618_gr);
  CONSTX #(.size(10), .\const (22)) inst227 (.data(inst227_data));
  CMPX #(.size(10)) inst207 (.A(inst227_data), .B(X), .ls(inst207_ls), .eq(inst207_eq));  // open: gr
  CONSTX #(.size(10), .\const (23)) inst229 (.data(inst229_data));
  and inst758 (pp, inst763_out, inst761_out);
  CONSTX #(.size(10), .\const (10)) inst173 (.data(inst173_data));
  or inst396 (inst396_out, inst177_gr, inst177_eq);
  or inst595 (inst595_out, inst588_gr, inst588_eq);
  or inst610 (inst610_out, inst603_gr, inst603_eq);
  and inst656 (glava11, lvl11x, lvl11y);
  and inst671 (glava12, lvl12x, lvl12y);
  CONSTX #(.size(10), .\const (25)) inst696 (.data(inst696_data));
  CMPX #(.size(10)) inst687 (.A(inst696_data), .B(X), .ls(inst687_ls));  // open: eq, gr
  or inst409 (inst409_out, inst207_eq, inst207_ls);
  CMPX #(.size(10)) inst214 (.A(inst229_data), .B(X), .ls(inst214_ls), .eq(inst214_eq));  // open: gr
  and inst147 (lvl3y, inst384_out, inst383_out);
  and inst154 (o, inst389_out, inst387_out);
  and inst771 (m, inst775_out, inst774_out);
  CMPX #(.size(10)) inst166 (.A(inst173_data), .B(Y), .eq(inst166_eq), .gr(inst166_gr));  // open: ls
  or inst393 (inst393_out, inst166_eq, inst166_gr);
  or inst580 (inst580_out, inst573_gr, inst573_eq);
  and inst593 (glava8, lvl8x, lvl8y);
  and inst608 (glava9, lvl9x, lvl9y);
  and inst623 (glava10, lvl10x, lvl10y);
  CONSTX #(.size(10), .\const (21)) inst225 (.data(inst225_data));
  CMPX #(.size(10)) inst200 (.A(inst225_data), .B(X), .ls(inst200_ls), .eq(inst200_eq));  // open: gr
  or inst414 (inst414_out, inst214_eq, inst214_ls);
  and inst125 (lvl1y, inst370_out, inst369_out);
  and inst136 (lvl2y, inst381_out, inst379_out);
  CONSTX #(.size(10), .\const (8)) inst766 (.data(inst766_data));
  and inst182 (glava6, lvl6x, lvl6y);
  and inst578 (glava7, lvl7x, lvl7y);
  CONSTX #(.size(10), .\const (26)) inst194 (.data(inst194_data));
  CONSTX #(.size(10), .\const (6)) inst157 (.data(inst157_data));
  CMPX #(.size(10)) inst144 (.A(inst157_data), .B(Y), .eq(inst144_eq), .gr(inst144_gr));  // open: ls
  CONSTX #(.size(10), .\const (8)) inst162 (.data(inst162_data));
  CMPX #(.size(10)) inst151 (.A(inst162_data), .B(Y), .eq(inst151_eq), .gr(inst151_gr));  // open: ls
  CMPX #(.size(10)) inst402 (.A(inst766_data), .B(Y), .eq(inst402_eq), .gr(inst402_gr));  // open: ls
  or inst763 (inst763_out, inst402_eq, inst402_gr);
  CONSTX #(.size(10), .\const (8)) inst777 (.data(inst777_data));
  CMPX #(.size(10)) inst764 (.A(inst777_data), .B(Y), .eq(inst764_eq), .gr(inst764_gr));  // open: ls
  or inst775 (inst775_out, inst764_eq, inst764_gr);
  and inst171 (glava5, lvl5x, lvl5y);
  CONSTX #(.size(10), .\const (20)) inst678 (.data(inst678_data));
  CMPX #(.size(10)) inst185 (.A(inst194_data), .B(X), .ls(inst185_ls));  // open: eq, gr
  or inst406 (inst406_out, inst200_eq, inst200_ls);
  and inst210 (lvl15x, inst410_out, inst409_out);
  and inst217 (lvl16x, inst412_out, inst414_out);
  CONSTX #(.size(10), .\const (2)) inst129 (.data(inst129_data));
  CMPX #(.size(10)) inst122 (.A(inst129_data), .B(Y), .eq(inst122_eq), .gr(inst122_gr));  // open: ls
  or inst384 (inst384_out, inst144_gr, inst144_eq);
  or inst389 (inst389_out, inst151_eq, inst151_gr);
  CONSTX #(.size(10), .\const (26)) inst663 (.data(inst663_data));
  CMPX #(.size(10)) inst643 (.A(inst663_data), .B(X), .ls(inst643_ls));  // open: eq, gr
  CMPX #(.size(10)) inst667 (.A(inst678_data), .B(X), .ls(inst667_ls), .eq(inst667_eq));  // open: gr
  and inst690 (kk, inst688_gr, inst687_ls);
  CONSTX #(.size(10), .\const (4)) inst140 (.data(inst140_data));
  CMPX #(.size(10)) inst133 (.A(inst140_data), .B(Y), .eq(inst133_eq), .gr(inst133_gr));  // open: ls
  or inst381 (inst381_out, inst133_eq, inst133_gr);
  and inst760 (glava19, pp, p);
  and inst773 (glava18, m, mm);
  CONSTX #(.size(10), .\const (19)) inst192 (.data(inst192_data));
  CONSTX #(.size(10), .\const (19)) inst599 (.data(inst599_data));
  CMPX #(.size(10)) inst589 (.A(inst599_data), .B(X), .ls(inst589_ls), .eq(inst589_eq));  // open: gr
  CONSTX #(.size(10), .\const (27)) inst615 (.data(inst615_data));
  CONSTX #(.size(10), .\const (20)) inst639 (.data(inst639_data));
  CMPX #(.size(10)) inst619 (.A(inst639_data), .B(X), .ls(inst619_ls), .eq(inst619_eq));  // open: gr
  or inst675 (inst675_out, inst667_eq, inst667_ls);
  and inst203 (lvl14x, inst201_gr, inst406_out);
  or inst412 (inst412_out, inst215_eq, inst215_gr);
  or inst370 (inst370_out, inst122_gr, inst122_eq);
  and inst149 (glava3, lvl3x, lvl3y);
  and inst156 (glava4, o, oo);
  CMPX #(.size(10)) inst178 (.A(inst192_data), .B(X), .ls(inst178_ls), .eq(inst178_eq));  // open: gr
  CONSTX #(.size(10), .\const (27)) inst584 (.data(inst584_data));
  CMPX #(.size(10)) inst574 (.A(inst584_data), .B(X), .ls(inst574_ls));  // open: eq, gr
  or inst596 (inst596_out, inst589_eq, inst589_ls);
  CMPX #(.size(10)) inst604 (.A(inst615_data), .B(X), .ls(inst604_ls));  // open: eq, gr
  and inst188 (lvl13x, inst400_out, inst185_ls);
  CONSTX #(.size(10), .\const (28)) inst228 (.data(inst228_data));
  CMPX #(.size(10)) inst208 (.A(inst228_data), .B(X), .eq(inst208_eq), .gr(inst208_gr));  // open: ls
  CONSTX #(.size(10), .\const (27)) inst230 (.data(inst230_data));
  CMPX #(.size(10)) inst215 (.A(inst230_data), .B(X), .eq(inst215_eq), .gr(inst215_gr));  // open: ls
  and inst127 (glava1, lvl1x, lvl1y);
  and inst138 (glava2, lvl2x, lvl2y);
  CONSTX #(.size(10), .\const (19)) inst174 (.data(inst174_data));
  CMPX #(.size(10)) inst167 (.A(inst174_data), .B(X), .ls(inst167_ls), .eq(inst167_eq));  // open: gr
  or inst397 (inst397_out, inst178_eq, inst178_ls);
  or inst636 (inst636_out, inst619_eq, inst619_ls);
  CONSTX #(.size(10), .\const (30)) inst698 (.data(inst698_data));
  CMPX #(.size(10)) inst688 (.A(inst698_data), .B(X), .gr(inst688_gr));  // open: ls, eq
  or inst410 (inst410_out, inst208_gr, inst208_eq);
  and inst655 (lvl11x, inst658_out, inst643_ls);
  and inst670 (lvl12x, inst668_gr, inst675_out);
  or inst400 (inst400_out, inst186_eq, inst186_gr);
  CONSTX #(.size(10), .\const (25)) inst226 (.data(inst226_data));
  CMPX #(.size(10)) inst201 (.A(inst226_data), .B(X), .gr(inst201_gr));  // open: ls, eq
  CONSTX #(.size(10), .\const (21)) inst159 (.data(inst159_data));
  CONSTX #(.size(10), .\const (23)) inst767 (.data(inst767_data));
  CMPX #(.size(10)) inst756 (.A(inst767_data), .B(X), .ls(inst756_ls));  // open: eq, gr
  CONSTX #(.size(10), .\const (27)) inst778 (.data(inst778_data));
  or inst394 (inst394_out, inst167_eq, inst167_ls);
  and inst592 (lvl8x, inst590_gr, inst596_out);
  and inst607 (lvl9x, inst612_out, inst604_ls);
  and inst622 (lvl10x, inst620_gr, inst636_out);
  CONSTX #(.size(10), .\const (30)) inst195 (.data(inst195_data));
  CMPX #(.size(10)) inst186 (.A(inst195_data), .B(X), .eq(inst186_eq), .gr(inst186_gr));  // open: ls
  CMPX #(.size(10)) inst145 (.A(inst159_data), .B(X), .ls(inst145_ls), .eq(inst145_eq));  // open: gr
  CONSTX #(.size(10), .\const (20)) inst163 (.data(inst163_data));
  CMPX #(.size(10)) inst152 (.A(inst163_data), .B(X), .ls(inst152_ls), .eq(inst152_eq));  // open: gr
  CMPX #(.size(10)) inst769 (.A(inst778_data), .B(X), .ls(inst769_ls));  // open: eq, gr
  and inst181 (lvl6x, inst179_gr, inst397_out);
  and inst577 (lvl7x, inst582_out, inst574_ls);
  or inst658 (inst658_out, inst653_eq, inst653_gr);
  CONSTX #(.size(10), .\const (23)) inst130 (.data(inst130_data));
  CMPX #(.size(10)) inst123 (.A(inst130_data), .B(X), .ls(inst123_ls), .eq(inst123_eq));  // open: gr
  CONSTX #(.size(10), .\const (22)) inst141 (.data(inst141_data));
  or inst385 (inst385_out, inst145_eq, inst145_ls);
  and inst170 (lvl5x, inst392_out, inst394_out);
  CONSTX #(.size(10), .\const (30)) inst664 (.data(inst664_data));
  CMPX #(.size(10)) inst653 (.A(inst664_data), .B(X), .eq(inst653_eq), .gr(inst653_gr));  // open: ls
  CONSTX #(.size(10), .\const (24)) inst679 (.data(inst679_data));
  CMPX #(.size(10)) inst668 (.A(inst679_data), .B(X), .gr(inst668_gr));  // open: ls, eq
  or inst373 (inst373_out, inst123_eq, inst123_ls);
  CMPX #(.size(10)) inst134 (.A(inst141_data), .B(X), .ls(inst134_ls), .eq(inst134_eq));  // open: gr
  or inst390 (inst390_out, inst152_eq, inst152_ls);
  CONSTX #(.size(10), .\const (23)) inst193 (.data(inst193_data));
  CONSTX #(.size(10), .\const (23)) inst601 (.data(inst601_data));
  CMPX #(.size(10)) inst590 (.A(inst601_data), .B(X), .gr(inst590_gr));  // open: ls, eq
  CONSTX #(.size(10), .\const (31)) inst616 (.data(inst616_data));
  CMPX #(.size(10)) inst605 (.A(inst616_data), .B(X), .eq(inst605_eq), .gr(inst605_gr));  // open: ls
  CONSTX #(.size(10), .\const (24)) inst640 (.data(inst640_data));
  CMPX #(.size(10)) inst620 (.A(inst640_data), .B(X), .gr(inst620_gr));  // open: ls, eq
  or inst382 (inst382_out, inst134_eq, inst134_ls);
  and inst759 (p, inst757_gr, inst756_ls);
  and inst772 (mm, inst_out, inst769_ls);
  or inst392 (inst392_out, inst168_eq, inst168_gr);
  CMPX #(.size(10)) inst179 (.A(inst193_data), .B(X), .gr(inst179_gr));  // open: ls, eq
  CONSTX #(.size(10), .\const (31)) inst586 (.data(inst586_data));
  CMPX #(.size(10)) inst575 (.A(inst586_data), .B(X), .eq(inst575_eq), .gr(inst575_gr));  // open: ls
  or inst612 (inst612_out, inst605_gr, inst605_eq);
  and inst148 (lvl3x, inst386_out, inst385_out);
  and inst155 (oo, inst153_gr, inst390_out);
  or inst (inst_out, inst770_eq, inst770_gr);
  CONSTX #(.size(10), .\const (31)) inst175 (.data(inst175_data));
  CMPX #(.size(10)) inst168 (.A(inst175_data), .B(X), .eq(inst168_eq), .gr(inst168_gr));  // open: ls
  or inst582 (inst582_out, inst575_gr, inst575_eq);
  and inst126 (lvl1x, inst377_out, inst373_out);
  and inst137 (lvl2x, inst380_out, inst382_out);
  CONSTX #(.size(10), .\const (27)) inst768 (.data(inst768_data));
  CMPX #(.size(10)) inst757 (.A(inst768_data), .B(X), .gr(inst757_gr));  // open: ls, eq
  CONSTX #(.size(10), .\const (30)) inst779 (.data(inst779_data));
  CMPX #(.size(10)) inst770 (.A(inst779_data), .B(X), .eq(inst770_eq), .gr(inst770_gr));  // open: ls
  or inst380 (inst380_out, inst135_eq, inst135_gr);
  CONSTX #(.size(10), .\const (29)) inst160 (.data(inst160_data));
  CMPX #(.size(10)) inst146 (.A(inst160_data), .B(X), .eq(inst146_eq), .gr(inst146_gr));  // open: ls
  CONSTX #(.size(10), .\const (23)) inst164 (.data(inst164_data));
  CMPX #(.size(10)) inst153 (.A(inst164_data), .B(X), .gr(inst153_gr));  // open: ls, eq
  CONSTX #(.size(10), .\const (27)) inst131 (.data(inst131_data));
  CMPX #(.size(10)) inst124 (.A(inst131_data), .B(X), .eq(inst124_eq), .gr(inst124_gr));  // open: ls
  CONSTX #(.size(10), .\const (28)) inst142 (.data(inst142_data));
  CMPX #(.size(10)) inst135 (.A(inst142_data), .B(X), .eq(inst135_eq), .gr(inst135_gr));  // open: ls
  or inst386 (inst386_out, inst146_gr, inst146_eq);
  or inst377 (inst377_out, inst124_gr, inst124_eq);
  CONSTX #(.size(10), .\const (46)) inst494 (.data(inst494_data));
  CONSTX #(.size(10), .\const (48)) inst496 (.data(inst496_data));
  or inst484 (inst484_out, inst473_eq, inst473_ls);
  CONSTX #(.size(10), .\const (40)) inst488 (.data(inst488_data));
  or inst455 (inst455_out, inst348_eq, inst348_ls);
  or inst462 (inst462_out, inst367_eq, inst367_ls);
  CMPX #(.size(10)) inst466 (.A(inst494_data), .B(Y), .ls(inst466_ls), .eq(inst466_eq));  // open: gr
  CMPX #(.size(10)) inst473 (.A(inst496_data), .B(Y), .ls(inst473_ls), .eq(inst473_eq));  // open: gr
  CONSTX #(.size(10), .\const (36)) inst317 (.data(inst317_data));
  or inst447 (inst447_out, inst295_eq, inst295_ls);
  CMPX #(.size(10)) inst341 (.A(inst488_data), .B(Y), .ls(inst341_ls), .eq(inst341_eq));  // open: gr
  CONSTX #(.size(10), .\const (42)) inst490 (.data(inst490_data));
  CMPX #(.size(10)) inst348 (.A(inst490_data), .B(Y), .ls(inst348_ls), .eq(inst348_eq));  // open: gr
  CONSTX #(.size(10), .\const (44)) inst492 (.data(inst492_data));
  CMPX #(.size(10)) inst367 (.A(inst492_data), .B(Y), .ls(inst367_ls), .eq(inst367_eq));  // open: gr
  or inst480 (inst480_out, inst466_eq, inst466_ls);
  CONSTX #(.size(10), .\const (30)) inst311 (.data(inst311_data));
  or inst435 (inst435_out, inst274_eq, inst274_ls);
  or inst439 (inst439_out, inst281_eq, inst281_ls);
  CMPX #(.size(10)) inst288 (.A(inst317_data), .B(Y), .ls(inst288_ls), .eq(inst288_eq));  // open: gr
  CONSTX #(.size(10), .\const (38)) inst319 (.data(inst319_data));
  CMPX #(.size(10)) inst295 (.A(inst319_data), .B(Y), .ls(inst295_ls), .eq(inst295_eq));  // open: gr
  or inst451 (inst451_out, inst341_eq, inst341_ls);
  CONSTX #(.size(10), .\const (24)) inst305 (.data(inst305_data));
  or inst423 (inst423_out, inst253_eq, inst253_ls);
  or inst427 (inst427_out, inst260_eq, inst260_ls);
  CMPX #(.size(10)) inst267 (.A(inst311_data), .B(Y), .ls(inst267_ls), .eq(inst267_eq));  // open: gr
  CONSTX #(.size(10), .\const (32)) inst313 (.data(inst313_data));
  CMPX #(.size(10)) inst274 (.A(inst313_data), .B(Y), .ls(inst274_ls), .eq(inst274_eq));  // open: gr
  CONSTX #(.size(10), .\const (34)) inst315 (.data(inst315_data));
  or inst443 (inst443_out, inst288_eq, inst288_ls);
  or inst415 (inst415_out, inst238_eq, inst238_ls);
  CMPX #(.size(10)) inst246 (.A(inst305_data), .B(Y), .ls(inst246_ls), .eq(inst246_eq));  // open: gr
  CONSTX #(.size(10), .\const (26)) inst307 (.data(inst307_data));
  CMPX #(.size(10)) inst253 (.A(inst307_data), .B(Y), .ls(inst253_ls), .eq(inst253_eq));  // open: gr
  CONSTX #(.size(10), .\const (28)) inst309 (.data(inst309_data));
  or inst431 (inst431_out, inst267_eq, inst267_ls);
  CMPX #(.size(10)) inst281 (.A(inst315_data), .B(Y), .ls(inst281_ls), .eq(inst281_eq));  // open: gr
  and inst470 (lvl24y, inst481_out, inst480_out);
  CONSTX #(.size(10), .\const (20)) inst245 (.data(inst245_data));
  CMPX #(.size(10)) inst231 (.A(inst245_data), .B(Y), .ls(inst231_ls), .eq(inst231_eq));  // open: gr
  CONSTX #(.size(10), .\const (22)) inst303 (.data(inst303_data));
  or inst419 (inst419_out, inst246_eq, inst246_ls);
  CMPX #(.size(10)) inst260 (.A(inst309_data), .B(Y), .ls(inst260_ls), .eq(inst260_eq));  // open: gr
  and inst477 (lvl25y, inst486_out, inst484_out);
  or inst371 (inst371_out, inst231_eq, inst231_ls);
  CMPX #(.size(10)) inst238 (.A(inst303_data), .B(Y), .ls(inst238_ls), .eq(inst238_eq));  // open: gr
  and inst345 (lvl21y, inst452_out, inst451_out);
  and inst352 (lvl22y, inst457_out, inst455_out);
  and inst459 (lvl23y, inst464_out, inst462_out);
  CONSTX #(.size(10), .\const (48)) inst495 (.data(inst495_data));
  and inst292 (lvl19y, inst444_out, inst443_out);
  and inst299 (lvl20y, inst449_out, inst447_out);
  CMPX #(.size(10)) inst467 (.A(inst495_data), .B(Y), .eq(inst467_eq), .gr(inst467_gr));  // open: ls
  CONSTX #(.size(10), .\const (50)) inst497 (.data(inst497_data));
  CMPX #(.size(10)) inst474 (.A(inst497_data), .B(Y), .eq(inst474_eq), .gr(inst474_gr));  // open: ls
  or inst486 (inst486_out, inst474_eq, inst474_gr);
  and inst271 (t6y, inst432_out, inst431_out);
  and inst278 (lvl17y, inst437_out, inst435_out);
  and inst285 (lvl18y, inst441_out, inst439_out);
  CONSTX #(.size(10), .\const (42)) inst489 (.data(inst489_data));
  CMPX #(.size(10)) inst342 (.A(inst489_data), .B(Y), .eq(inst342_eq), .gr(inst342_gr));  // open: ls
  CONSTX #(.size(10), .\const (44)) inst491 (.data(inst491_data));
  CMPX #(.size(10)) inst349 (.A(inst491_data), .B(Y), .eq(inst349_eq), .gr(inst349_gr));  // open: ls
  or inst457 (inst457_out, inst349_eq, inst349_gr);
  CONSTX #(.size(10), .\const (46)) inst493 (.data(inst493_data));
  CMPX #(.size(10)) inst368 (.A(inst493_data), .B(Y), .eq(inst368_eq), .gr(inst368_gr));  // open: ls
  or inst464 (inst464_out, inst368_eq, inst368_gr);
  or inst481 (inst481_out, inst467_gr, inst467_eq);
  and inst250 (t3y, inst420_out, inst419_out);
  and inst257 (t4y, inst425_out, inst423_out);
  and inst264 (t5y, inst429_out, inst427_out);
  CONSTX #(.size(10), .\const (38)) inst318 (.data(inst318_data));
  CMPX #(.size(10)) inst289 (.A(inst318_data), .B(Y), .eq(inst289_eq), .gr(inst289_gr));  // open: ls
  CONSTX #(.size(10), .\const (40)) inst320 (.data(inst320_data));
  CMPX #(.size(10)) inst296 (.A(inst320_data), .B(Y), .eq(inst296_eq), .gr(inst296_gr));  // open: ls
  or inst449 (inst449_out, inst296_eq, inst296_gr);
  or inst452 (inst452_out, inst342_gr, inst342_eq);
  and inst472 (telo14, lvl24x, lvl24y);
  and inst479 (telo15, lvl25x, lvl25y);
  and inst235 (t1y, inst372_out, inst371_out);
  and inst242 (t2y, inst417_out, inst415_out);
  CONSTX #(.size(10), .\const (32)) inst312 (.data(inst312_data));
  CMPX #(.size(10)) inst268 (.A(inst312_data), .B(Y), .eq(inst268_eq), .gr(inst268_gr));  // open: ls
  CONSTX #(.size(10), .\const (34)) inst314 (.data(inst314_data));
  CMPX #(.size(10)) inst275 (.A(inst314_data), .B(Y), .eq(inst275_eq), .gr(inst275_gr));  // open: ls
  or inst437 (inst437_out, inst275_eq, inst275_gr);
  CONSTX #(.size(10), .\const (36)) inst316 (.data(inst316_data));
  CMPX #(.size(10)) inst282 (.A(inst316_data), .B(Y), .eq(inst282_eq), .gr(inst282_gr));  // open: ls
  or inst444 (inst444_out, inst289_gr, inst289_eq);
  and inst347 (telo11, lvl21x, lvl21y);
  CONSTX #(.size(10), .\const (26)) inst306 (.data(inst306_data));
  CMPX #(.size(10)) inst247 (.A(inst306_data), .B(Y), .eq(inst247_eq), .gr(inst247_gr));  // open: ls
  CONSTX #(.size(10), .\const (28)) inst308 (.data(inst308_data));
  CMPX #(.size(10)) inst254 (.A(inst308_data), .B(Y), .eq(inst254_eq), .gr(inst254_gr));  // open: ls
  or inst425 (inst425_out, inst254_eq, inst254_gr);
  CONSTX #(.size(10), .\const (30)) inst310 (.data(inst310_data));
  CMPX #(.size(10)) inst261 (.A(inst310_data), .B(Y), .eq(inst261_eq), .gr(inst261_gr));  // open: ls
  or inst432 (inst432_out, inst268_gr, inst268_eq);
  or inst441 (inst441_out, inst282_eq, inst282_gr);
  and inst294 (telo9, lvl19x, lvl19y);
  and inst366 (telo12, lvl22x, lvl22y);
  and inst461 (telo13, lvl23x, lvl23y);
  CONSTX #(.size(10), .\const (22)) inst302 (.data(inst302_data));
  CMPX #(.size(10)) inst232 (.A(inst302_data), .B(Y), .eq(inst232_eq), .gr(inst232_gr));  // open: ls
  CONSTX #(.size(10), .\const (24)) inst304 (.data(inst304_data));
  CMPX #(.size(10)) inst239 (.A(inst304_data), .B(Y), .eq(inst239_eq), .gr(inst239_gr));  // open: ls
  or inst420 (inst420_out, inst247_gr, inst247_eq);
  or inst429 (inst429_out, inst261_eq, inst261_gr);
  and inst273 (telo6, t6y, t6x);
  and inst301 (telo10, lvl20x, lvl20y);
  or inst372 (inst372_out, inst232_gr, inst232_eq);
  or inst417 (inst417_out, inst239_eq, inst239_gr);
  and inst252 (telo3, t3x, t3y);
  and inst280 (telo7, lvl17x, lvl17y);
  and inst287 (telo8, lvl18x, lvl18y);
  CONSTX #(.size(10), .\const (16)) inst504 (.data(inst504_data));
  CMPX #(.size(10)) inst468 (.A(inst504_data), .B(X), .ls(inst468_ls), .eq(inst468_eq));  // open: gr
  CONSTX #(.size(10), .\const (17)) inst506 (.data(inst506_data));
  and inst259 (telo4, t4x, t4y);
  and inst266 (telo5, t5y, t5x);
  CONSTX #(.size(10), .\const (18)) inst498 (.data(inst498_data));
  CONSTX #(.size(10), .\const (14)) inst500 (.data(inst500_data));
  CONSTX #(.size(10), .\const (15)) inst502 (.data(inst502_data));
  or inst482 (inst482_out, inst468_eq, inst468_ls);
  CMPX #(.size(10)) inst475 (.A(inst506_data), .B(X), .ls(inst475_ls), .eq(inst475_eq));  // open: gr
  and inst237 (telo1, t1x, t1y);
  and inst244 (telo2, t2x, t2y);
  CONSTX #(.size(10), .\const (11)) inst323 (.data(inst323_data));
  CONSTX #(.size(10), .\const (18)) inst321 (.data(inst321_data));
  CMPX #(.size(10)) inst343 (.A(inst498_data), .B(X), .ls(inst343_ls), .eq(inst343_eq));  // open: gr
  or inst453 (inst453_out, inst343_eq, inst343_ls);
  CMPX #(.size(10)) inst350 (.A(inst500_data), .B(X), .ls(inst350_ls), .eq(inst350_eq));  // open: gr
  CMPX #(.size(10)) inst375 (.A(inst502_data), .B(X), .ls(inst375_ls), .eq(inst375_eq));  // open: gr
  or inst487 (inst487_out, inst475_eq, inst475_ls);
  CONSTX #(.size(10), .\const (12)) inst329 (.data(inst329_data));
  CONSTX #(.size(10), .\const (11)) inst327 (.data(inst327_data));
  CONSTX #(.size(10), .\const (10)) inst325 (.data(inst325_data));
  CMPX #(.size(10)) inst290 (.A(inst323_data), .B(X), .ls(inst290_ls), .eq(inst290_eq));  // open: gr
  or inst445 (inst445_out, inst290_eq, inst290_ls);
  CMPX #(.size(10)) inst297 (.A(inst321_data), .B(X), .ls(inst297_ls), .eq(inst297_eq));  // open: gr
  or inst458 (inst458_out, inst350_eq, inst350_ls);
  or inst465 (inst465_out, inst375_eq, inst375_ls);
  CONSTX #(.size(10), .\const (15)) inst335 (.data(inst335_data));
  CONSTX #(.size(10), .\const (14)) inst333 (.data(inst333_data));
  CMPX #(.size(10)) inst269 (.A(inst329_data), .B(X), .ls(inst269_ls), .eq(inst269_eq));  // open: gr
  or inst433 (inst433_out, inst269_eq, inst269_ls);
  CMPX #(.size(10)) inst276 (.A(inst327_data), .B(X), .ls(inst276_ls), .eq(inst276_eq));  // open: gr
  CMPX #(.size(10)) inst283 (.A(inst325_data), .B(X), .ls(inst283_ls), .eq(inst283_eq));  // open: gr
  or inst450 (inst450_out, inst297_eq, inst297_ls);
  and inst471 (lvl24x, inst483_out, inst482_out);
  and inst478 (lvl25x, inst485_out, inst487_out);
  CONSTX #(.size(10), .\const (17)) inst339 (.data(inst339_data));
  CONSTX #(.size(10), .\const (16)) inst337 (.data(inst337_data));
  CMPX #(.size(10)) inst248 (.A(inst335_data), .B(X), .ls(inst248_ls), .eq(inst248_eq));  // open: gr
  or inst421 (inst421_out, inst248_eq, inst248_ls);
  CMPX #(.size(10)) inst255 (.A(inst333_data), .B(X), .ls(inst255_ls), .eq(inst255_eq));  // open: gr
  CONSTX #(.size(10), .\const (13)) inst331 (.data(inst331_data));
  CMPX #(.size(10)) inst262 (.A(inst331_data), .B(X), .ls(inst262_ls), .eq(inst262_eq));  // open: gr
  or inst438 (inst438_out, inst276_eq, inst276_ls);
  or inst442 (inst442_out, inst283_eq, inst283_ls);
  and inst346 (lvl21x, inst454_out, inst453_out);
  CMPX #(.size(10)) inst233 (.A(inst339_data), .B(X), .ls(inst233_ls), .eq(inst233_eq));  // open: gr
  or inst374 (inst374_out, inst233_eq, inst233_ls);
  CMPX #(.size(10)) inst240 (.A(inst337_data), .B(X), .ls(inst240_ls), .eq(inst240_eq));  // open: gr
  or inst426 (inst426_out, inst255_eq, inst255_ls);
  or inst430 (inst430_out, inst262_eq, inst262_ls);
  and inst293 (lvl19x, inst446_out, inst445_out);
  and inst365 (lvl22x, inst456_out, inst458_out);
  and inst460 (lvl23x, inst463_out, inst465_out);
  or inst485 (inst485_out, inst476_eq, inst476_gr);
  or inst418 (inst418_out, inst240_eq, inst240_ls);
  and inst272 (t6x, inst434_out, inst433_out);
  and inst300 (lvl20x, inst448_out, inst450_out);
  or inst456 (inst456_out, inst351_eq, inst351_gr);
  or inst463 (inst463_out, inst376_eq, inst376_gr);
  CONSTX #(.size(10), .\const (34)) inst505 (.data(inst505_data));
  CMPX #(.size(10)) inst469 (.A(inst505_data), .B(X), .eq(inst469_eq), .gr(inst469_gr));  // open: ls
  CONSTX #(.size(10), .\const (33)) inst507 (.data(inst507_data));
  CMPX #(.size(10)) inst476 (.A(inst507_data), .B(X), .eq(inst476_eq), .gr(inst476_gr));  // open: ls
  and inst251 (t3x, inst422_out, inst421_out);
  and inst279 (lvl17x, inst436_out, inst438_out);
  and inst286 (lvl18x, inst440_out, inst442_out);
  or inst448 (inst448_out, inst298_eq, inst298_gr);
  CONSTX #(.size(10), .\const (32)) inst499 (.data(inst499_data));
  CMPX #(.size(10)) inst344 (.A(inst499_data), .B(X), .eq(inst344_eq), .gr(inst344_gr));  // open: ls
  CONSTX #(.size(10), .\const (36)) inst501 (.data(inst501_data));
  CMPX #(.size(10)) inst351 (.A(inst501_data), .B(X), .eq(inst351_eq), .gr(inst351_gr));  // open: ls
  CONSTX #(.size(10), .\const (35)) inst503 (.data(inst503_data));
  or inst483 (inst483_out, inst469_gr, inst469_eq);
  and inst258 (t4x, inst424_out, inst426_out);
  and inst265 (t5x, inst428_out, inst430_out);
  or inst436 (inst436_out, inst277_eq, inst277_gr);
  or inst440 (inst440_out, inst284_eq, inst284_gr);
  CONSTX #(.size(10), .\const (39)) inst324 (.data(inst324_data));
  CMPX #(.size(10)) inst291 (.A(inst324_data), .B(X), .eq(inst291_eq), .gr(inst291_gr));  // open: ls
  CONSTX #(.size(10), .\const (32)) inst322 (.data(inst322_data));
  CMPX #(.size(10)) inst298 (.A(inst322_data), .B(X), .eq(inst298_eq), .gr(inst298_gr));  // open: ls
  or inst454 (inst454_out, inst344_gr, inst344_eq);
  CMPX #(.size(10)) inst376 (.A(inst503_data), .B(X), .eq(inst376_eq), .gr(inst376_gr));  // open: ls
  and inst236 (t1x, inst378_out, inst374_out);
  and inst243 (t2x, inst416_out, inst418_out);
  or inst424 (inst424_out, inst256_eq, inst256_gr);
  or inst428 (inst428_out, inst263_eq, inst263_gr);
  CONSTX #(.size(10), .\const (38)) inst330 (.data(inst330_data));
  CMPX #(.size(10)) inst270 (.A(inst330_data), .B(X), .eq(inst270_eq), .gr(inst270_gr));  // open: ls
  CONSTX #(.size(10), .\const (39)) inst328 (.data(inst328_data));
  or inst446 (inst446_out, inst291_gr, inst291_eq);
  or inst416 (inst416_out, inst241_eq, inst241_gr);
  CONSTX #(.size(10), .\const (35)) inst336 (.data(inst336_data));
  CMPX #(.size(10)) inst249 (.A(inst336_data), .B(X), .eq(inst249_eq), .gr(inst249_gr));  // open: ls
  CONSTX #(.size(10), .\const (36)) inst334 (.data(inst334_data));
  CMPX #(.size(10)) inst256 (.A(inst334_data), .B(X), .eq(inst256_eq), .gr(inst256_gr));  // open: ls
  or inst434 (inst434_out, inst270_gr, inst270_eq);
  CMPX #(.size(10)) inst277 (.A(inst328_data), .B(X), .eq(inst277_eq), .gr(inst277_gr));  // open: ls
  CONSTX #(.size(10), .\const (40)) inst326 (.data(inst326_data));
  CMPX #(.size(10)) inst284 (.A(inst326_data), .B(X), .eq(inst284_eq), .gr(inst284_gr));  // open: ls
  CONSTX #(.size(10), .\const (33)) inst340 (.data(inst340_data));
  CMPX #(.size(10)) inst234 (.A(inst340_data), .B(X), .eq(inst234_eq), .gr(inst234_gr));  // open: ls
  or inst422 (inst422_out, inst249_gr, inst249_eq);
  CONSTX #(.size(10), .\const (37)) inst332 (.data(inst332_data));
  CMPX #(.size(10)) inst263 (.A(inst332_data), .B(X), .eq(inst263_eq), .gr(inst263_gr));  // open: ls
  CONSTX #(.size(10), .\const (34)) inst338 (.data(inst338_data));
  CMPX #(.size(10)) inst241 (.A(inst338_data), .B(X), .eq(inst241_eq), .gr(inst241_gr));  // open: ls
  or inst378 (inst378_out, inst234_gr, inst234_eq);
  CONSTX #(.size(10), .\const (12)) inst628 (.data(inst628_data));
  CONSTX #(.size(10), .\const (13)) inst630 (.data(inst630_data));
  or inst555 (inst555_out, inst544_eq, inst544_ls);
  or inst566 (inst566_out, inst559_eq, inst559_ls);
  CONSTX #(.size(10), .\const (10)) inst536 (.data(inst536_data));
  or inst532 (inst532_out, inst521_eq, inst521_ls);
  CMPX #(.size(10)) inst537 (.A(inst628_data), .B(Y), .ls(inst537_ls), .eq(inst537_eq));  // open: gr
  CMPX #(.size(10)) inst544 (.A(inst630_data), .B(Y), .ls(inst544_ls), .eq(inst544_eq));  // open: gr
  CONSTX #(.size(10), .\const (14)) inst632 (.data(inst632_data));
  CMPX #(.size(10)) inst512 (.A(inst536_data), .B(Y), .ls(inst512_ls), .eq(inst512_eq));  // open: gr
  CONSTX #(.size(10), .\const (11)) inst626 (.data(inst626_data));
  CMPX #(.size(10)) inst521 (.A(inst626_data), .B(Y), .ls(inst521_ls), .eq(inst521_eq));  // open: gr
  or inst551 (inst551_out, inst537_eq, inst537_ls);
  CMPX #(.size(10)) inst559 (.A(inst632_data), .B(Y), .ls(inst559_ls), .eq(inst559_eq));  // open: gr
  or inst528 (inst528_out, inst512_eq, inst512_ls);
  and inst541 (k3y, inst552_out, inst551_out);
  and inst548 (k4y, inst557_out, inst555_out);
  and inst563 (k5y, inst568_out, inst566_out);
  and inst518 (k1y, inst529_out, inst528_out);
  and inst525 (k2y, inst534_out, inst532_out);
  CONSTX #(.size(10), .\const (13)) inst629 (.data(inst629_data));
